# Altium project EPS.PrjPcb (part 1 of 4)
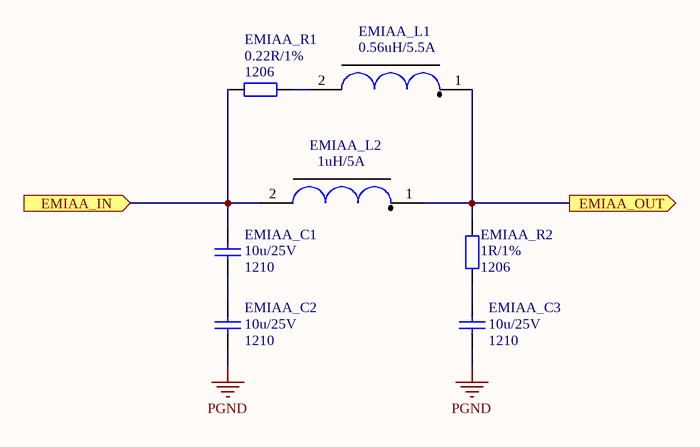
[diagram p0: EPS_3V3_EMI-Filter_In.SchDoc]
ApprovedBy_Name: (not approved); Author_Name: Piotr Kuligowski; CheckedBy_Name: (not checked); Equipment: EPS; Model: EM2; PCB_Author: (pcbdoc author); PCB_CheckedBy: (not checked); PCB_DocName: EPS; PCB_DocNo: PWSat2-xxx-DW-xxx; PCB_Revision: 1; Project_FullName: PW-Sat2; Project_ShortName: PW-Sat2; Schematics_DocName: EPS; Schematics_DocNo: PWSat2-xxx-DW-xxx; Schematics_Revision: 2
39 sheets, 761 parts. Net scope: hierarchical (ports join the sheet entries above them; power ports are global).
Board file: EPS.PcbDoc
Sheets:
  EPS_3V3_EMI-Filter_In.SchDoc
  EPS_3V3_EMI-Filter_Out.SchDoc
  EPS_5V_EMI-Filter_In.SchDoc
  EPS_Battery_Controller_Current-Meas.SchDoc
  EPS_5V_Buck-Converter.SchDoc
  EPS_3V3_Buck-Converter.SchDoc
  EPS_Connectors.SchDoc
    Top = EPS_Top.SchDoc
      Controller A = EPS_CTRL_A.SchDoc
        I2C Repeater = EPS_I2C-Repeater.SchDoc
        CTRL-A_Supply = EPS_CTRL_AB_Supply.SchDoc
        Temperature-Sensor = EPS_Temperature-Sensor.SchDoc
      MPPT X = EPS_MPPT_X.SchDoc
        MPPTX Boost Converter = EPS_MPPT_X_Boost-Converter.SchDoc
        MPPTX Solar Panels ORing = EPS_MPPT_X_OR_Solar.SchDoc
        MPPTX EMI Filters for Solar Panels = EPS_MPPT_X_EMI-Filter_Solar-Panels.SchDoc
        MPPTX Interface to uC = EPS_MPPT_XY_Interface.SchDoc
        MPPTX Measurements = EPS_MPPT_XY_Measurements.SchDoc
        MPPTX Output EMI Filter = EPS_MPPT_X_EMI-Filter_Out.SchDoc
        MPPTX ORing to MPB = EPS_MPPT_X_OR_MPB.SchDoc
      MPPT Y+ = EPS_MPPT_Y.SchDoc
        MPPTY Buck-Boost Converter = EPS_MPPT_Y_Buck-Boost-Converter.SchDoc
        MPPTY Solar Panels ORing = EPS_MPPT_Y_OR_Solar.SchDoc
        MPPTY Interface to uC = EPS_MPPT_XY_Interface.SchDoc
        MPPTY Measurements = EPS_MPPT_XY_Measurements.SchDoc
        MPPTY ORing to MPB = EPS_MPPT_Y_OR_MPB.SchDoc
      RBL & Inrush Limit = EPS_RBL.SchDoc
      LCLs for DCDC = EPS_DCDC_RLCLs.SchDoc
        DCDC RLCL = EPS_DCDC_RLCL-FPF.SchDoc
        VBAT RLCL = EPS_DCDC_RLCL-FPF.SchDoc
      Local-Supply and WDTs = EPS_Local-Supply.SchDoc
        Local-Supply CTRL-A = EPS_Local-Supply_Channel.SchDoc
          Temperature-Sensor = EPS_Temperature-Sensor.SchDoc
        Local-Supply CTRL-B = EPS_Local-Supply_Channel.SchDoc
          Temperature-Sensor = EPS_Temperature-Sensor.SchDoc
      MPPT Y- = EPS_MPPT_Y.SchDoc
        MPPTY Buck-Boost Converter = EPS_MPPT_Y_Buck-Boost-Converter.SchDoc
        MPPTY Solar Panels ORing = EPS_MPPT_Y_OR_Solar.SchDoc
        MPPTY Interface to uC = EPS_MPPT_XY_Interface.SchDoc
        MPPTY Measurements = EPS_MPPT_XY_Measurements.SchDoc
        MPPTY ORing to MPB = EPS_MPPT_Y_OR_MPB.SchDoc
      Controller B = EPS_CTRL_B.SchDoc
        I2C Repeater = EPS_I2C-Repeater.SchDoc
        Temperature-Sensor = EPS_Temperature-Sensor.SchDoc
        CTRL-B_Supply = EPS_CTRL_AB_Supply.SchDoc
    PC-104 Stack Connector = EPS_Connectors_PC-104.SchDoc
  EPS_Distribution_LCL-FPF.SchDoc
  EPS_Distribution_LCL-TK.SchDoc
  EPS_Distribution_RLCL-FPF.SchDoc
  EPS_Battery_Heaters-Control.SchDoc
  EPS_Distribution_Measurements.SchDoc
  EPS_VBAT_EMI-Filter.SchDoc
  EPS_Battery_Controller_Diode.SchDoc
  EPS_Battery_Controller_RLCL.SchDoc

## Sheet EPS_3V3_EMI-Filter_In.SchDoc: 3V3 / EMI-Filter / In
size A4; ApprovedBy: (not approved); CheckedBy: (not checked); Author: Piotr Kuligowski; DocumentNumber: PWSat2-xxx-DW-xxx; Revision: 2; SheetNumber: 40; SheetTotal: 51; Model: EM2

### Parts
EMIAA_C1  Package: 1210  [SMD_Capacitor_1210]  (hidden comment: 10u/25V)
EMIAA_C2  Package: 1210  [SMD_Capacitor_1210]  (hidden comment: 10u/25V)
EMIAA_C3  Package: 1210  [SMD_Capacitor_1210]  (hidden comment: 10u/25V)
EMIAA_L1  0.56uH/5.5A  [Vishay_IHLP1212]
EMIAA_L2  1uH/5A  [Vishay_IHLP1212]
EMIAA_R1  Package: 1206  [SMD_Resistor_1206]  (hidden comment: 0.22R/1%)
EMIAA_R2  Package: 1206  [SMD_Resistor_1206]  (hidden comment: 1R/1%)

### Ports
EMIAA_IN (in), EMIAA_OUT (out)

### Nets
PGND: EMIAA_C2.2 EMIAA_C3.2
NetEMIAA_C1_1: EMIAA_C1.1 EMIAA_L2.2 EMIAA_R1.1 ; port EMIAA_IN
NetEMIAA_C1_2: EMIAA_C1.2 EMIAA_C2.1
NetEMIAA_C3_1: EMIAA_C3.1 EMIAA_R2.1
NetEMIAA_L1_1: EMIAA_L1.1 EMIAA_L2.1 EMIAA_R2.2 ; port EMIAA_OUT
NetEMIAA_L1_2: EMIAA_L1.2 EMIAA_R1.2

### Notes on the sheet
- Title:
- Project:
- Author:
- Model:
- Document Number:
- Checked by:
- Rev:
- Date:
- Approved by:
- Sheet:
- of
- File name:

### Library data of the parts
EMIAA_C1-EMIAA_C3 = Cer_GCJ32ER71E106KA12L: Ceramic Cap Murata Automotive 10u/25V X7R 1210; Manufacturer: Murata; ManufacturerPartNumber: GCJ32ER71E106KA12L; Value: 10u/25V
EMIAA_L1 = IHLP1212BZERR56M11: Vishay IHLP1212 Inductor, L=0.56uH, Irise40deg=5.5A, ESR=16mR, SRF=1MHz.; Manufacturer: Vishay; ManufacturerPartNumber: IHLP1212BZERR56M11; Value: 0.56uH/5.5A
EMIAA_L2 = IHLP1212BZER1R0M11: Vishay IHLP1212 Inductor, L=1uH, Irise40deg=5A, ESR=20mR, SRF=1MHz.; Manufacturer: Vishay; ManufacturerPartNumber: IHLP1212BZER1R0M11; Value: 1uH/5A
EMIAA_R1 = ERJ-8BQFR22V: Panasonic Resistor 0.22R 1% 1206 330mW; Manufacturer: Panasonic; ManufacturerPartNumber: ERJ-8BQFR22V; Value: 0.22R/1%
EMIAA_R2 = ERJ-8BQF1R0V: Panasonic Resistor 1R 1% 1206 330mW; ManufacturerPartNumber: ERJ-8BQF1R0V; Manufacturer: Panasonic; Value: 1R/1%

## Sheet EPS_3V3_EMI-Filter_Out.SchDoc: 3V3 / EMI-Filter / Out
size A4; ApprovedBy: (not approved); CheckedBy: (not checked); Author: Piotr Kuligowski; DocumentNumber: PWSat2-xxx-DW-xxx; Revision: 2; SheetNumber: 42; SheetTotal: 51; Model: EM2
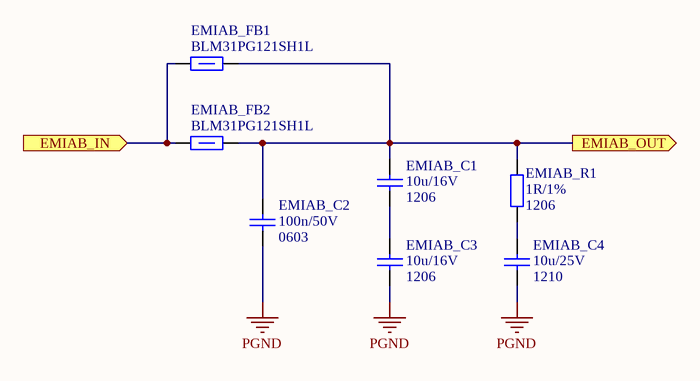
[diagram p1: EPS_3V3_EMI-Filter_Out.SchDoc]

### Parts
EMIAB_C1  Packge: 1206  [SMD_Capacitor_1206]  (hidden comment: 10u/16V)
EMIAB_C2  Package: 0603  [SMD_Capacitor_0603]  (hidden comment: 100n/50V)
EMIAB_C3  Packge: 1206  [SMD_Capacitor_1206]  (hidden comment: 10u/16V)
EMIAB_C4  Package: 1210  [SMD_Capacitor_1210]  (hidden comment: 10u/25V)
EMIAB_FB1  120R/100MHz  [SMD_FerriteBead_1206]  (value not drawn)
EMIAB_FB2  120R/100MHz  [SMD_FerriteBead_1206]  (value not drawn)
EMIAB_R1  Package: 1206  [SMD_Resistor_1206]  (hidden comment: 1R/1%)

### Ports
EMIAB_IN (in), EMIAB_OUT (out)

### Nets
PGND: EMIAB_C2.2 EMIAB_C3.2 EMIAB_C4.2
NetEMIAB_C1_1: EMIAB_C1.1 EMIAB_C2.1 EMIAB_FB1.1 EMIAB_FB2.1 EMIAB_R1.1 ; port EMIAB_OUT
NetEMIAB_C1_2: EMIAB_C1.2 EMIAB_C3.1
NetEMIAB_C4_1: EMIAB_C4.1 EMIAB_R1.2
NetEMIAB_FB1_2: EMIAB_FB1.2 EMIAB_FB2.2 ; port EMIAB_IN

### Notes on the sheet
- Title:
- Project:
- Author:
- Model:
- Document Number:
- Checked by:
- Rev:
- Date:
- Approved by:
- Sheet:
- of
- File name:

### Library data of the parts
EMIAB_C1 EMIAB_C3 = Cer_C1206T106K4RACTU: Ceramic Cap Kemet COTS 10u/16V X7R 1206; ManufacturerPartNumber: C1206T106K4RACTU; Manufacturer: Kemet; Value: 10u/16V
EMIAB_C2 = Cer_C0603T104K5RALTU: Ceramic Cap Kemet COTS 100n/50V X7R 0603; Manufacturer: Kemet; ManufacturerPartNumber: C0603T104K5RALTU; Value: 100n/50V
EMIAB_C4 = Cer_GCJ32ER71E106KA12L: as EMIAA_C1 on sheet EPS_3V3_EMI-Filter_In; Manufacturer: Murata; ManufacturerPartNumber: GCJ32ER71E106KA12L; Value: 10u/25V
EMIAB_FB1 EMIAB_FB2 = BLM31PG121SH1L: Ferrite bead, 1206, 0.02HM, 3.5A.; Manufacturer: Murata; Current Rating: 3.5A; Series Resistance DC: 0.02R; Package: 1206; Value: 120R/100MHz; ManufacturerPartNumber: BLM31PG121SH1L
EMIAB_R1 = CRCW12061R00FKxxxx: 1R/1% Vishay CRCW 1206 Resistor. 250mW, 100ppm, 200V.; ManufacturerPartNumber: CRCW12061R00FKxxxx; Manufacturer: Vishay; Value: 1R/1%

## Sheet EPS_5V_EMI-Filter_In.SchDoc: 5V / EMI-Filter / In
size A4; ApprovedBy: (not approved); CheckedBy: (not checked); Author: Piotr Kuligowski; DocumentNumber: PWSat2-xxx-DW-xxx; Revision: 2; SheetNumber: 44; SheetTotal: 51; Model: EM2
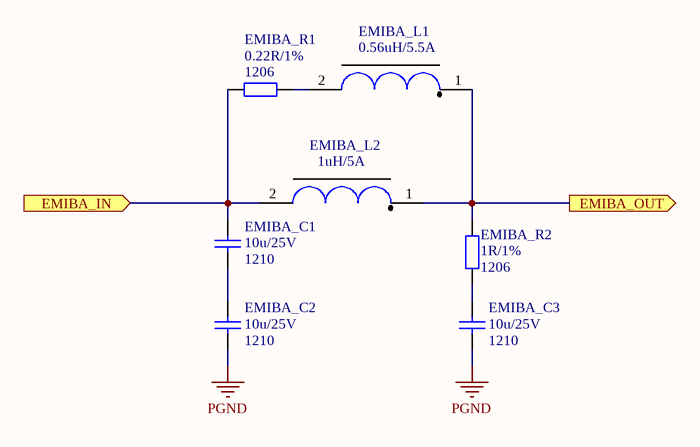
[diagram p2: EPS_5V_EMI-Filter_In.SchDoc]

### Parts
EMIBA_C1  Package: 1210  [SMD_Capacitor_1210]  (hidden comment: 10u/25V)
EMIBA_C2  Package: 1210  [SMD_Capacitor_1210]  (hidden comment: 10u/25V)
EMIBA_C3  Package: 1210  [SMD_Capacitor_1210]  (hidden comment: 10u/25V)
EMIBA_L1  0.56uH/5.5A  [Vishay_IHLP1212]
EMIBA_L2  1uH/5A  [Vishay_IHLP1212]
EMIBA_R1  Package: 1206  [SMD_Resistor_1206]  (hidden comment: 0.22R/1%)
EMIBA_R2  Package: 1206  [SMD_Resistor_1206]  (hidden comment: 1R/1%)

### Ports
EMIBA_IN (in), EMIBA_OUT (out)

### Nets
PGND: EMIBA_C2.2 EMIBA_C3.2
NetEMIBA_C1_1: EMIBA_C1.1 EMIBA_L2.2 EMIBA_R1.1 ; port EMIBA_IN
NetEMIBA_C1_2: EMIBA_C1.2 EMIBA_C2.1
NetEMIBA_C3_1: EMIBA_C3.1 EMIBA_R2.1
NetEMIBA_L1_1: EMIBA_L1.1 EMIBA_L2.1 EMIBA_R2.2 ; port EMIBA_OUT
NetEMIBA_L1_2: EMIBA_L1.2 EMIBA_R1.2

### Notes on the sheet
- Title:
- Project:
- Author:
- Model:
- Document Number:
- Checked by:
- Rev:
- Date:
- Approved by:
- Sheet:
- of
- File name:

### Library data of the parts
EMIBA_C1-EMIBA_C3 = Cer_GCJ32ER71E106KA12L: as EMIAA_C1 on sheet EPS_3V3_EMI-Filter_In; Manufacturer: Murata; ManufacturerPartNumber: GCJ32ER71E106KA12L; Value: 10u/25V
EMIBA_L1 = IHLP1212BZERR56M11: as EMIAA_L1 on sheet EPS_3V3_EMI-Filter_In; Manufacturer: Vishay; ManufacturerPartNumber: IHLP1212BZERR56M11; Value: 0.56uH/5.5A
EMIBA_L2 = IHLP1212BZER1R0M11: as EMIAA_L2 on sheet EPS_3V3_EMI-Filter_In; Manufacturer: Vishay; ManufacturerPartNumber: IHLP1212BZER1R0M11; Value: 1uH/5A
EMIBA_R1 = ERJ-8BQFR22V: Panasonic Resistor 0.22R 1% 1206 330mW; Manufacturer: Panasonic; ManufacturerPartNumber: ERJ-8BQFR22V; Value: 0.22R/1%
EMIBA_R2 = ERJ-8BQF1R0V: Panasonic Resistor 1R 1% 1206 330mW; ManufacturerPartNumber: ERJ-8BQF1R0V; Manufacturer: Panasonic; Value: 1R/1%

## Sheet EPS_Battery_Controller_Current-Meas.SchDoc: Battery / Current Measurement
size A4; ApprovedBy: (not approved); CheckedBy: (not checked); Author: Piotr Kuligowski; DocumentNumber: PWSat2-xxx-DW-xxx; Revision: 2; SheetNumber: 29; SheetTotal: 51; Model: EM2
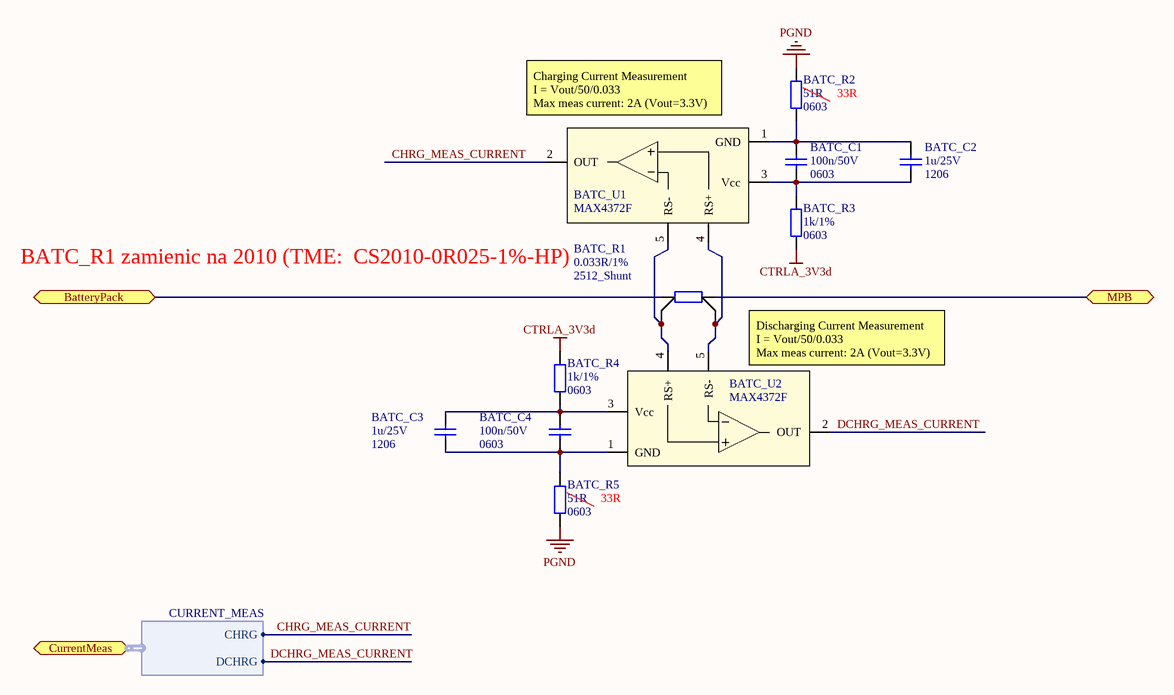
[diagram p3: EPS_Battery_Controller_Current-Meas.SchDoc]

### Parts
BATC_C1  Package: 0603  [SMD_Capacitor_0603]  (hidden comment: 100n/50V)
BATC_C2  Package: 1206  [SMD_Capacitor_1206]  (hidden comment: 1u/25V)
BATC_C3  Package: 1206  [SMD_Capacitor_1206]  (hidden comment: 1u/25V)
BATC_C4  Package: 0603  [SMD_Capacitor_0603]  (hidden comment: 100n/50V)
BATC_R1  Package: 2512_Shunt  [SMD_Resistor-shunt_2512]  (hidden comment: 0.033R/1%)
BATC_R2  Package: 0603  [SMD_Resistor_0603]  (hidden comment: 51R)
BATC_R3  Package: 0603  [SMD_Resistor_0603]  (hidden comment: 1k/1%)
BATC_R4  Package: 0603  [SMD_Resistor_0603]  (hidden comment: 1k/1%)
BATC_R5  Package: 0603  [SMD_Resistor_0603]  (hidden comment: 51R)
BATC_U1  MAX4372F  [SOT23-5]
BATC_U2  MAX4372F  [SOT23-5]

### Ports
BatteryPack, CurrentMeas (harness CURRENT_MEAS), MPB (bidir)

### Harnesses
CURRENT_MEAS: CHRG, DCHRG

### Nets
CTRLA_3V3d: BATC_R3.1 BATC_R4.1
PGND: BATC_R2.2 BATC_R5.1
CHRG_MEAS_CURRENT: BATC_U1.2(OUT) ; port CurrentMeas.CHRG
DCHRG_MEAS_CURRENT: BATC_U2.2(OUT) ; port CurrentMeas.DCHRG
NetBATC_C1_1: BATC_C1.1 BATC_C2.1 BATC_R2.1 BATC_U1.1(GND)
NetBATC_C1_2: BATC_C1.2 BATC_C2.2 BATC_R3.2 BATC_U1.3(Vcc)
NetBATC_C3_1: BATC_C3.1 BATC_C4.1 BATC_R4.2 BATC_U2.3(Vcc)
NetBATC_C3_2: BATC_C3.2 BATC_C4.2 BATC_R5.2 BATC_U2.1(GND)
NetBATC_R1_1: BATC_R1.1 ; port BatteryPack
NetBATC_R1_2: BATC_R1.2 BATC_U1.5(RS-) BATC_U2.4(RS+)
NetBATC_R1_3: BATC_R1.3 BATC_U1.4(RS+) BATC_U2.5(RS-)
NetBATC_R1_4: BATC_R1.4 ; port MPB

### Notes on the sheet
- (near BATC_U1) Charging Current Measurement
  I = Vout/50/0.033
  Max meas current: 2A (Vout=3.3V)
- (near BATC_R2) 33R
- (near BATC_U1) BATC_R1 zamienic na 2010 (TME:  CS2010-0R025-1%-HP)
- (near BATC_U2) Discharging Current Measurement
  I = Vout/50/0.033
  Max meas current: 2A (Vout=3.3V)
- 33R
- Title:
- Project:
- Author:
- Model:
- Document Number:
- Checked by:
- Rev:
- Date:
- Approved by:
- Sheet:
- of
- File name:

### Library data of the parts
BATC_C1 BATC_C4 = Cer_GCJ188R71H104KA12D: Ceramic Cap Murata Automotive 100n/50V X7R 0603; Manufacturer: Murata; ManufacturerPartNumber: GCJ188R71H104KA12D; Value: 100n/50V
BATC_C2 BATC_C3 = Cer_C1206T105K3RALTU: Ceramic Cap Kemet COTS 1u/25V X7R 1206; ManufacturerPartNumber: C1206T105K3RALTU; Manufacturer: Kemet; Value: 1u/25V
BATC_R1 = LR2512-R033FW: 33mR ,1%, 2W, shunt resistor, TE Connectivity.; ManufacturerPartNumber: LR2512-R033FW; Manufacturer: TE Connectivity; Power Rating: 2W; Value: 0.033R/1%
BATC_R2-BATC_R5 = Res
  BATC_R2 BATC_R5: Value: 51R
  BATC_R3 BATC_R4: Value: 1k/1%
BATC_U1 BATC_U2 = MAX4372: High-Side Current-Sense Amplifier with Voltage Output; Manufacturer: Maxim Integrated Products; Value: MAX4372F

## Sheet EPS_5V_Buck-Converter.SchDoc: 5V / Buck-Converter
size A4; ApprovedBy: (not approved); CheckedBy: (not checked); Author: Piotr Kuligowski; DocumentNumber: PWSat2-xxx-DW-xxx; Revision: 2; SheetNumber: 45; SheetTotal: 51; Model: EM2
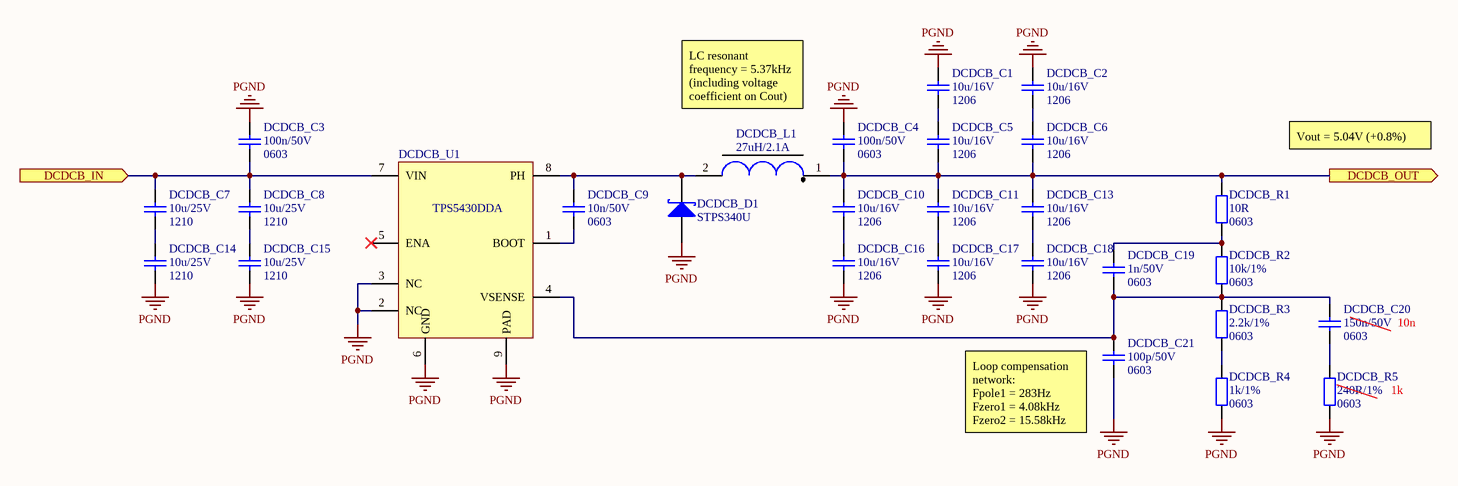
[diagram p4: EPS_5V_Buck-Converter.SchDoc]

### Parts
DCDCB_C1  Packge: 1206  [SMD_Capacitor_1206]  (hidden comment: 10u/16V)
DCDCB_C2  Packge: 1206  [SMD_Capacitor_1206]  (hidden comment: 10u/16V)
DCDCB_C3  Package: 0603  [SMD_Capacitor_0603]  (hidden comment: 100n/50V)
DCDCB_C4  Package: 0603  [SMD_Capacitor_0603]  (hidden comment: 100n/50V)
DCDCB_C5  Packge: 1206  [SMD_Capacitor_1206]  (hidden comment: 10u/16V)
DCDCB_C6  Packge: 1206  [SMD_Capacitor_1206]  (hidden comment: 10u/16V)
DCDCB_C7  Package: 1210  [SMD_Capacitor_1210]  (hidden comment: 10u/25V)
DCDCB_C8  Package: 1210  [SMD_Capacitor_1210]  (hidden comment: 10u/25V)
DCDCB_C9  value 10n/50V  Package: 0603  [SMD_Capacitor_0603]  (hidden comment: Cap)
DCDCB_C10  Packge: 1206  [SMD_Capacitor_1206]  (hidden comment: 10u/16V)
DCDCB_C11  Packge: 1206  [SMD_Capacitor_1206]  (hidden comment: 10u/16V)
DCDCB_C13  Packge: 1206  [SMD_Capacitor_1206]  (hidden comment: 10u/16V)
DCDCB_C14  Package: 1210  [SMD_Capacitor_1210]  (hidden comment: 10u/25V)
DCDCB_C15  Package: 1210  [SMD_Capacitor_1210]  (hidden comment: 10u/25V)
DCDCB_C16  Packge: 1206  [SMD_Capacitor_1206]  (hidden comment: 10u/16V)
DCDCB_C17  Packge: 1206  [SMD_Capacitor_1206]  (hidden comment: 10u/16V)
DCDCB_C18  Packge: 1206  [SMD_Capacitor_1206]  (hidden comment: 10u/16V)
DCDCB_C19  value 1n/50V  Package: 0603  [SMD_Capacitor_0603]  (hidden comment: Cap)
DCDCB_C20  Package: 0603  [SMD_Capacitor_0603]  (hidden comment: 150n/50V)
DCDCB_C21  value 100p/50V  Package: 0603  [SMD_Capacitor_0603]  (hidden comment: Cap)
DCDCB_D1  STPS340U  [DO-214AA]
DCDCB_L1  27uH/2.1A  [Coilcraft_MSS1260]
DCDCB_R1  Package: 0603  [SMD_Resistor_0603]  (hidden comment: 10R)
DCDCB_R2  Package: 0603  [SMD_Resistor_0603]  (hidden comment: 10k/1%)
DCDCB_R3  Package: 0603  [SMD_Resistor_0603]  (hidden comment: 2.2k/1%)
DCDCB_R4  Package: 0603  [SMD_Resistor_0603]  (hidden comment: 1k/1%)
DCDCB_R5  Package: 0603  [SMD_Resistor_0603]  (hidden comment: 240R/1%)
DCDCB_U1  TPS5430DDA  [DDA-9]

### Ports
DCDCB_IN (in), DCDCB_OUT (out)

### Nets
PGND: DCDCB_C1.1 DCDCB_C2.1 DCDCB_C3.2 DCDCB_C4.2 DCDCB_C14.2 DCDCB_C15.2 DCDCB_C16.2 DCDCB_C17.2 DCDCB_C18.2 DCDCB_C21.2 DCDCB_D1.A DCDCB_R4.1 DCDCB_R5.1 DCDCB_U1.2(NC) DCDCB_U1.3(NC) DCDCB_U1.6(GND) DCDCB_U1.9(PAD)
NetDCDCB_C1_2: DCDCB_C1.2 DCDCB_C5.1
NetDCDCB_C2_2: DCDCB_C2.2 DCDCB_C6.1
NetDCDCB_C3_1: DCDCB_C3.1 DCDCB_C7.1 DCDCB_C8.1 DCDCB_U1.7(VIN) ; port DCDCB_IN
NetDCDCB_C4_1: DCDCB_C4.1 DCDCB_C5.2 DCDCB_C6.2 DCDCB_C10.1 DCDCB_C11.1 DCDCB_C13.1 DCDCB_L1.1 DCDCB_R1.2 ; port DCDCB_OUT
NetDCDCB_C7_2: DCDCB_C7.2 DCDCB_C14.1
NetDCDCB_C8_2: DCDCB_C8.2 DCDCB_C15.1
NetDCDCB_C9_1: DCDCB_C9.1 DCDCB_D1.K DCDCB_L1.2 DCDCB_U1.8(PH)
NetDCDCB_C9_2: DCDCB_C9.2 DCDCB_U1.1(BOOT)
NetDCDCB_C10_2: DCDCB_C10.2 DCDCB_C16.1
NetDCDCB_C11_2: DCDCB_C11.2 DCDCB_C17.1
NetDCDCB_C13_2: DCDCB_C13.2 DCDCB_C18.1
NetDCDCB_C19_1: DCDCB_C19.1 DCDCB_R1.1 DCDCB_R2.2
NetDCDCB_C19_2: DCDCB_C19.2 DCDCB_C20.1 DCDCB_C21.1 DCDCB_R2.1 DCDCB_R3.2 DCDCB_U1.4(VSENSE)
NetDCDCB_C20_2: DCDCB_C20.2 DCDCB_R5.2
NetDCDCB_R3_1: DCDCB_R3.1 DCDCB_R4.2

Not connected (* = marked no-connect by the designer): DCDCB_U1 5(ENA)*

### Notes on the sheet
- LC resonant frequency = 5.37kHz (including voltage coefficient on Cout)
- Vout = 5.04V (+0.8%)
- 10n
- 1k
- (near DCDCB_C21) Loop compensation network:
  Fpole1 = 283Hz
  Fzero1 = 4.08kHz
  Fzero2 = 15.58kHz
- Title:
- Project:
- Author:
- Model:
- Document Number:
- Checked by:
- Rev:
- Date:
- Approved by:
- Sheet:
- of
- File name:

### Library data of the parts
DCDCB_C1 DCDCB_C2 DCDCB_C5 DCDCB_C6 DCDCB_C10 DCDCB_C11 DCDCB_C13 DCDCB_C16-DCDCB_C18 = Cer_C1206T106K4RACTU: Ceramic Cap Kemet COTS 10u/16V X7R 1206; ManufacturerPartNumber: C1206T106K4RACTU; Manufacturer: Kemet; Value: 10u/16V
DCDCB_C3 DCDCB_C4 = Cer_GCJ188R71H104KA12D: as BATC_C1 on sheet EPS_Battery_Controller_Current-Meas; Manufacturer: Murata; ManufacturerPartNumber: GCJ188R71H104KA12D; Value: 100n/50V
DCDCB_C7 DCDCB_C8 DCDCB_C14 DCDCB_C15 = Cer_GCJ32ER71E106KA12L: as EMIAA_C1 on sheet EPS_3V3_EMI-Filter_In; Manufacturer: Murata; ManufacturerPartNumber: GCJ32ER71E106KA12L; Value: 10u/25V
DCDCB_C20 = Cer_GCM188R71H154KA64D: Ceramic Cap Murata Automotive 150n/50V X7R 0603; Manufacturer: Murata; ManufacturerPartNumber: GCM188R71H154KA64D; Value: 150n/50V
DCDCB_D1 = STPS340x: 3A/40V Power Schottky Rectifier.; Manufacturer: STMicroelectronics; Value: STPS340U
DCDCB_L1 = MSS1260-273MLx: Coilcraft MSS1260 Inductor, L=27uH, Irise20deg=2.1A, ESR=50mR, SRF=13MHz.; Manufacturer: Coilcraft; ManufacturerPartNumber: MSS1260-273MLx; Value: 27uH/2.1A
DCDCB_R1-DCDCB_R5 = Res
  DCDCB_R1: Value: 10R
  DCDCB_R2: Value: 10k/1%
  DCDCB_R3: Value: 2.2k/1%
  DCDCB_R4: Value: 1k/1%
  DCDCB_R5: Value: 240R/1%
DCDCB_U1 = TPS5430: TPS5430 3-A, Wide Input Range, Step-Down Converter; Manufacturer: Texas Instruments; Value: TPS5430DDA

## Sheet EPS_3V3_Buck-Converter.SchDoc: 3V3 / Buck-Converter
size A4; ApprovedBy: (not approved); CheckedBy: (not checked); Author: Piotr Kuligowski; DocumentNumber: PWSat2-xxx-DW-xxx; Revision: 2; SheetNumber: 41; SheetTotal: 51; Model: EM2
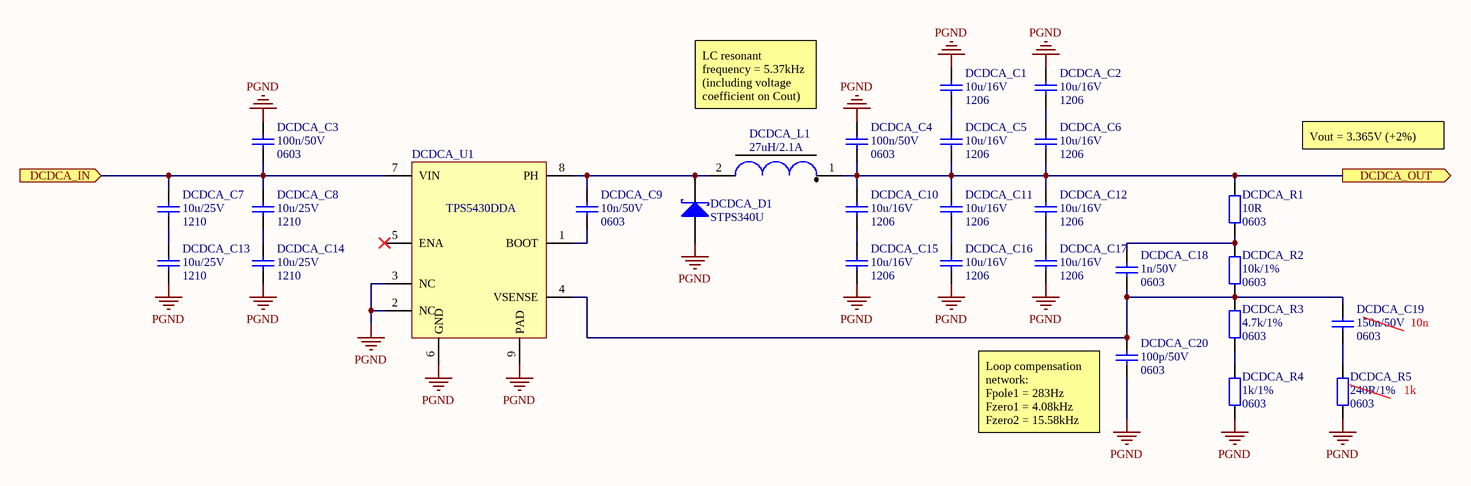
[diagram p5: EPS_3V3_Buck-Converter.SchDoc]

### Parts
DCDCA_C1  Packge: 1206  [SMD_Capacitor_1206]  (hidden comment: 10u/16V)
DCDCA_C2  Packge: 1206  [SMD_Capacitor_1206]  (hidden comment: 10u/16V)
DCDCA_C3  Package: 0603  [SMD_Capacitor_0603]  (hidden comment: 100n/50V)
DCDCA_C4  Package: 0603  [SMD_Capacitor_0603]  (hidden comment: 100n/50V)
DCDCA_C5  Packge: 1206  [SMD_Capacitor_1206]  (hidden comment: 10u/16V)
DCDCA_C6  Packge: 1206  [SMD_Capacitor_1206]  (hidden comment: 10u/16V)
DCDCA_C7  Package: 1210  [SMD_Capacitor_1210]  (hidden comment: 10u/25V)
DCDCA_C8  Package: 1210  [SMD_Capacitor_1210]  (hidden comment: 10u/25V)
DCDCA_C9  value 10n/50V  Package: 0603  [SMD_Capacitor_0603]  (hidden comment: Cap)
DCDCA_C10  Packge: 1206  [SMD_Capacitor_1206]  (hidden comment: 10u/16V)
DCDCA_C11  Packge: 1206  [SMD_Capacitor_1206]  (hidden comment: 10u/16V)
DCDCA_C12  Packge: 1206  [SMD_Capacitor_1206]  (hidden comment: 10u/16V)
DCDCA_C13  Package: 1210  [SMD_Capacitor_1210]  (hidden comment: 10u/25V)
DCDCA_C14  Package: 1210  [SMD_Capacitor_1210]  (hidden comment: 10u/25V)
DCDCA_C15  Packge: 1206  [SMD_Capacitor_1206]  (hidden comment: 10u/16V)
DCDCA_C16  Packge: 1206  [SMD_Capacitor_1206]  (hidden comment: 10u/16V)
DCDCA_C17  Packge: 1206  [SMD_Capacitor_1206]  (hidden comment: 10u/16V)
DCDCA_C18  value 1n/50V  Package: 0603  [SMD_Capacitor_0603]  (hidden comment: Cap)
DCDCA_C19  Package: 0603  [SMD_Capacitor_0603]  (hidden comment: 150n/50V)
DCDCA_C20  value 100p/50V  Package: 0603  [SMD_Capacitor_0603]  (hidden comment: Cap)
DCDCA_D1  STPS340U  [DO-214AA]
DCDCA_L1  27uH/2.1A  [Coilcraft_MSS1260]
DCDCA_R1  Package: 0603  [SMD_Resistor_0603]  (hidden comment: 10R)
DCDCA_R2  Package: 0603  [SMD_Resistor_0603]  (hidden comment: 10k/1%)
DCDCA_R3  Package: 0603  [SMD_Resistor_0603]  (hidden comment: 4.7k/1%)
DCDCA_R4  Package: 0603  [SMD_Resistor_0603]  (hidden comment: 1k/1%)
DCDCA_R5  Package: 0603  [SMD_Resistor_0603]  (hidden comment: 240R/1%)
DCDCA_U1  TPS5430DDA  [DDA-9]

### Ports
DCDCA_IN (in), DCDCA_OUT (out)

### Nets
PGND: DCDCA_C1.1 DCDCA_C2.1 DCDCA_C3.2 DCDCA_C4.2 DCDCA_C13.2 DCDCA_C14.2 DCDCA_C15.2 DCDCA_C16.2 DCDCA_C17.2 DCDCA_C20.2 DCDCA_D1.A DCDCA_R4.1 DCDCA_R5.1 DCDCA_U1.2(NC) DCDCA_U1.3(NC) DCDCA_U1.6(GND) DCDCA_U1.9(PAD)
NetDCDCA_C1_2: DCDCA_C1.2 DCDCA_C5.1
NetDCDCA_C2_2: DCDCA_C2.2 DCDCA_C6.1
NetDCDCA_C3_1: DCDCA_C3.1 DCDCA_C7.1 DCDCA_C8.1 DCDCA_U1.7(VIN) ; port DCDCA_IN
NetDCDCA_C4_1: DCDCA_C4.1 DCDCA_C5.2 DCDCA_C6.2 DCDCA_C10.1 DCDCA_C11.1 DCDCA_C12.1 DCDCA_L1.1 DCDCA_R1.2 ; port DCDCA_OUT
NetDCDCA_C7_2: DCDCA_C7.2 DCDCA_C13.1
NetDCDCA_C8_2: DCDCA_C8.2 DCDCA_C14.1
NetDCDCA_C9_1: DCDCA_C9.1 DCDCA_D1.K DCDCA_L1.2 DCDCA_U1.8(PH)
NetDCDCA_C9_2: DCDCA_C9.2 DCDCA_U1.1(BOOT)
NetDCDCA_C10_2: DCDCA_C10.2 DCDCA_C15.1
NetDCDCA_C11_2: DCDCA_C11.2 DCDCA_C16.1
NetDCDCA_C12_2: DCDCA_C12.2 DCDCA_C17.1
NetDCDCA_C18_1: DCDCA_C18.1 DCDCA_R1.1 DCDCA_R2.2
NetDCDCA_C18_2: DCDCA_C18.2 DCDCA_C19.1 DCDCA_C20.1 DCDCA_R2.1 DCDCA_R3.2 DCDCA_U1.4(VSENSE)
NetDCDCA_C19_2: DCDCA_C19.2 DCDCA_R5.2
NetDCDCA_R3_1: DCDCA_R3.1 DCDCA_R4.2

Not connected (* = marked no-connect by the designer): DCDCA_U1 5(ENA)*

### Notes on the sheet
- LC resonant frequency = 5.37kHz (including voltage coefficient on Cout)
- Vout = 3.365V (+2%)
- 10n
- 1k
- (near DCDCA_C20) Loop compensation network:
  Fpole1 = 283Hz
  Fzero1 = 4.08kHz
  Fzero2 = 15.58kHz
- Title:
- Project:
- Author:
- Model:
- Document Number:
- Checked by:
- Rev:
- Date:
- Approved by:
- Sheet:
- of
- File name:

### Library data of the parts
DCDCA_C1 DCDCA_C2 DCDCA_C5 DCDCA_C6 DCDCA_C10-DCDCA_C12 DCDCA_C15-DCDCA_C17 = Cer_C1206T106K4RACTU: Ceramic Cap Kemet COTS 10u/16V X7R 1206; ManufacturerPartNumber: C1206T106K4RACTU; Manufacturer: Kemet; Value: 10u/16V
DCDCA_C3 DCDCA_C4 = Cer_GCJ188R71H104KA12D: as BATC_C1 on sheet EPS_Battery_Controller_Current-Meas; Manufacturer: Murata; ManufacturerPartNumber: GCJ188R71H104KA12D; Value: 100n/50V
DCDCA_C7 DCDCA_C8 DCDCA_C13 DCDCA_C14 = Cer_GCJ32ER71E106KA12L: as EMIAA_C1 on sheet EPS_3V3_EMI-Filter_In; Manufacturer: Murata; ManufacturerPartNumber: GCJ32ER71E106KA12L; Value: 10u/25V
DCDCA_C19 = Cer_GCM188R71H154KA64D: as DCDCB_C20 on sheet EPS_5V_Buck-Converter; Manufacturer: Murata; ManufacturerPartNumber: GCM188R71H154KA64D; Value: 150n/50V
DCDCA_D1 = STPS340x: as DCDCB_D1 on sheet EPS_5V_Buck-Converter; Value: STPS340U
DCDCA_L1 = MSS1260-273MLx: as DCDCB_L1 on sheet EPS_5V_Buck-Converter; Manufacturer: Coilcraft; ManufacturerPartNumber: MSS1260-273MLx; Value: 27uH/2.1A
DCDCA_R1-DCDCA_R5 = Res
  DCDCA_R1: Value: 10R
  DCDCA_R2: Value: 10k/1%
  DCDCA_R3: Value: 4.7k/1%
  DCDCA_R4: Value: 1k/1%
  DCDCA_R5: Value: 240R/1%
DCDCA_U1 = TPS5430: as DCDCB_U1 on sheet EPS_5V_Buck-Converter; Value: TPS5430DDA

## Sheet EPS_Connectors.SchDoc: Connectors
size A3; ApprovedBy: (not approved); CheckedBy: (not checked); Author: Piotr Kuligowski; DocumentNumber: PWSat2-xxx-DW-xxx; Revision: 2; SheetNumber: 1; SheetTotal: 51; Model: EM2
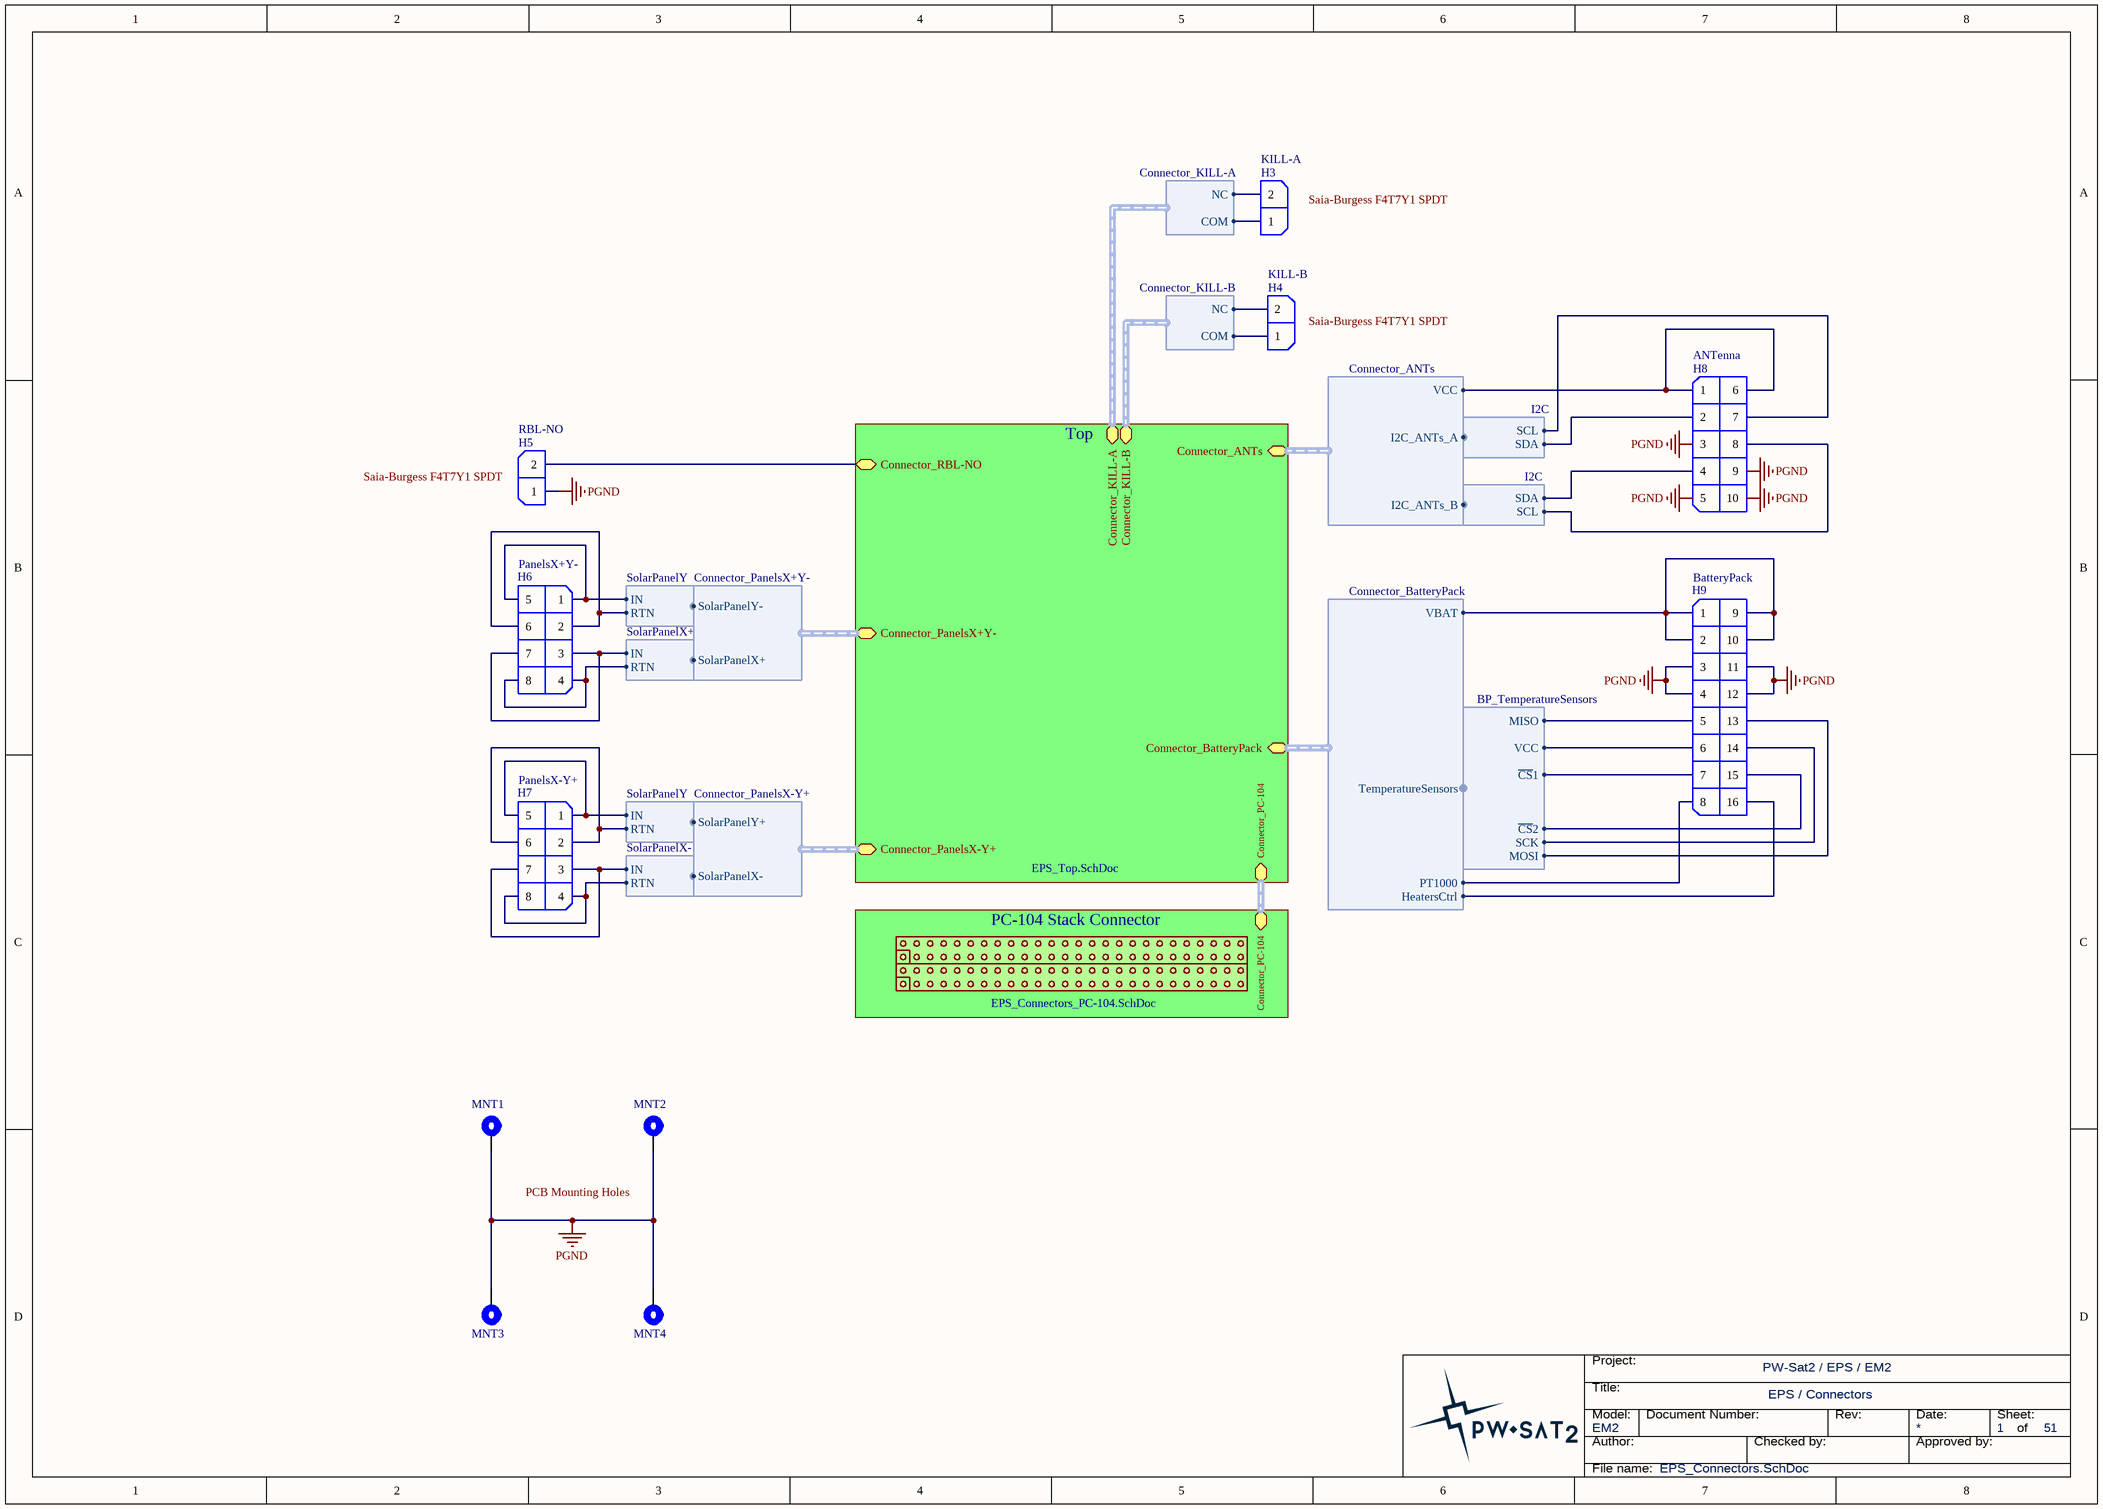
[diagram p6: EPS_Connectors.SchDoc]

### Parts
H3  KILL-A  [Harwin_Datamate_L-Tek_M80-8770222]
H4  KILL-B  [Harwin_Datamate_L-Tek_M80-8770222]
H5  RBL-NO  [Harwin_Datamate_L-Tek_M80-8770222]
H6  PanelsX+Y-  [Harwin_Datamate_L-Tek_M80-8670805]
H7  PanelsX-Y+  [Harwin_Datamate_L-Tek_M80-8670805]
H8  ANTenna  [Harwin_Datamate_L-Tek_M80-8671005]
H9  BatteryPack  [Harwin_Datamate_L-Tek_M80-8531642]
MNT1  Mounting Hole  [PC-104_PcbMntHole_M3]  (value not drawn)
MNT2  Mounting Hole  [PC-104_PcbMntHole_M3]  (value not drawn)
MNT3  Mounting Hole  [PC-104_PcbMntHole_M3]  (value not drawn)
MNT4  Mounting Hole  [PC-104_PcbMntHole_M3]  (value not drawn)

### Sub-sheets
PC-104 Stack Connector = EPS_Connectors_PC-104.SchDoc: Connector_PC-104 (harness Connector_PC-104)
Top = EPS_Top.SchDoc: Connector_PC-104 (harness Connector_PC-104), Connector_KILL-B (harness Connector_KILL-B), Connector_KILL-A (harness Connector_KILL-A), Connector_PanelsX+Y- (harness Connector_PanelsX+Y-), Connector_PanelsX-Y+ (harness Connector_PanelsX-Y+), Connector_ANTs (harness Connector_ANTs), Connector_BatteryPack (harness Connector_BatteryPack), Connector_RBL-NO (bidir)

### Harnesses
SolarPanelX-: IN, RTN
SolarPanelY: IN, RTN
SolarPanelX+: IN, RTN
Connector_PanelsX-Y+: SolarPanelX-, SolarPanelY+
Connector_PanelsX+Y-: SolarPanelX+, SolarPanelY-
Connector_KILL-A: COM, NC
Connector_KILL-B: COM, NC
I2C: SDA, SCL
Connector_ANTs: I2C_ANTs_A, VCC, I2C_ANTs_B
Connector_BatteryPack: VBAT, TemperatureSensors, HeatersCtrl, PT1000
BP_TemperatureSensors: MISO, VCC, ~{CS}1, ~{CS}2, SCK, MOSI

### Nets
PGND: H5.1 H8.3 H8.5 H8.9 H8.10 H9.3 H9.4 H9.11 H9.12 MNT1.1 MNT2.1 MNT3.1 MNT4.1
PC-104_I2C-Bus_SCL: H8.7 ; harness I2C.SCL
PC-104_I2C-Bus_SDA: H8.2 ; harness I2C.SDA
PC-104_I2C-Payload_SCL: H8.8 ; harness I2C.SCL
PC-104_I2C-Payload_SDA: H8.4 ; harness I2C.SDA
NetEMIXS_T1_1: H6.3 H6.7 ; harness SolarPanelX+.IN
NetEMIXS_T1_2: H6.4 H6.8 ; harness SolarPanelX+.RTN
NetEMIXS_T2_1: H7.3 H7.7 ; harness SolarPanelX-.IN
NetEMIXS_T2_2: H7.4 H7.8 ; harness SolarPanelX-.RTN
NetH3_1: H3.1 H4.1 ; sheet Top/Connector_KILL-A.COM, sheet Top/Connector_KILL-B.COM
NetH3_2: H3.2 H4.2 ; sheet Top/Connector_KILL-A.NC, sheet Top/Connector_KILL-B.NC
NetH5_2: H5.2 ; sheet Top/Connector_RBL-NO
NetH6_1: H6.1 H6.5 ; harness SolarPanelY.IN
NetH6_2: H6.2 H6.6 ; harness SolarPanelY.RTN
NetH7_1: H7.1 H7.5 ; harness SolarPanelY.IN
NetH7_2: H7.2 H7.6 ; harness SolarPanelY.RTN
NetH8_1: H8.1 H8.6 ; sheet Top/Connector_ANTs.VCC
NetH9_1: H9.1 H9.2 H9.9 H9.10 ; sheet Top/Connector_BatteryPack.VBAT
NetH9_5: H9.5 ; harness BP_TemperatureSensors.MISO
NetH9_6: H9.6 ; harness BP_TemperatureSensors.VCC
NetH9_7: H9.7 ; harness BP_TemperatureSensors.~{CS}1
NetH9_8: H9.8 ; sheet Top/Connector_BatteryPack.PT1000
NetH9_13: H9.13 ; harness BP_TemperatureSensors.MOSI
NetH9_14: H9.14 ; harness BP_TemperatureSensors.SCK
NetH9_15: H9.15 ; harness BP_TemperatureSensors.~{CS}2
NetH9_16: H9.16 ; sheet Top/Connector_BatteryPack.HeatersCtrl

### Buses and harness runs
harness sheet PC-104 Stack Connector/Connector_PC-104 = sheet Top/Connector_PC-104

### Notes on the sheet
- (near H3) Saia-Burgess F4T7Y1 SPDT
- (near H4) Saia-Burgess F4T7Y1 SPDT
- (near H5) Saia-Burgess F4T7Y1 SPDT
- PCB Mounting Holes
- Title:
- Project:
- Author:
- Model:
- Document Number:
- Checked by:
- Rev:
- Date:
- Approved by:
- Sheet:
- of
- File name:

### Library data of the parts
H3-H5 = Harwin_Datamate_L-Tek_1x2pin: Harwin DataMate L-Tek, 2mm pitch, 1x2pin.; Value: Harwin DataMate L-Tek 1x2pin
H6 H7 = Harwin_Datamate_L-Tek_2x4pin: Harwin DataMate L-Tek, 2mm pitch, 2x4pin.; Value: Harwin DataMate L-Tek 2x4pin
H8 = Harwin_Datamate_L-Tek_2x5pin: Harwin DataMate L-Tek, 2mm pitch, 2x5pin.; Value: Harwin DataMate L-Tek 2x5pin
H9 = Harwin_Datamate_L-Tek_2x8pin: Harwin DataMate L-Tek, 2mm pitch, 2x8pin.; Value: BatteryPack
MNT1-MNT4 = MntHole: PCB Mounting Hole; Value: Mounting Hole

## Sheet EPS_Top.SchDoc: Top
size A3; ApprovedBy: (not approved); CheckedBy: (not checked); Author: Piotr Kuligowski; DocumentNumber: PWSat2-xxx-DW-xxx; Revision: 2; SheetNumber: 3; SheetTotal: 51; Model: EM2
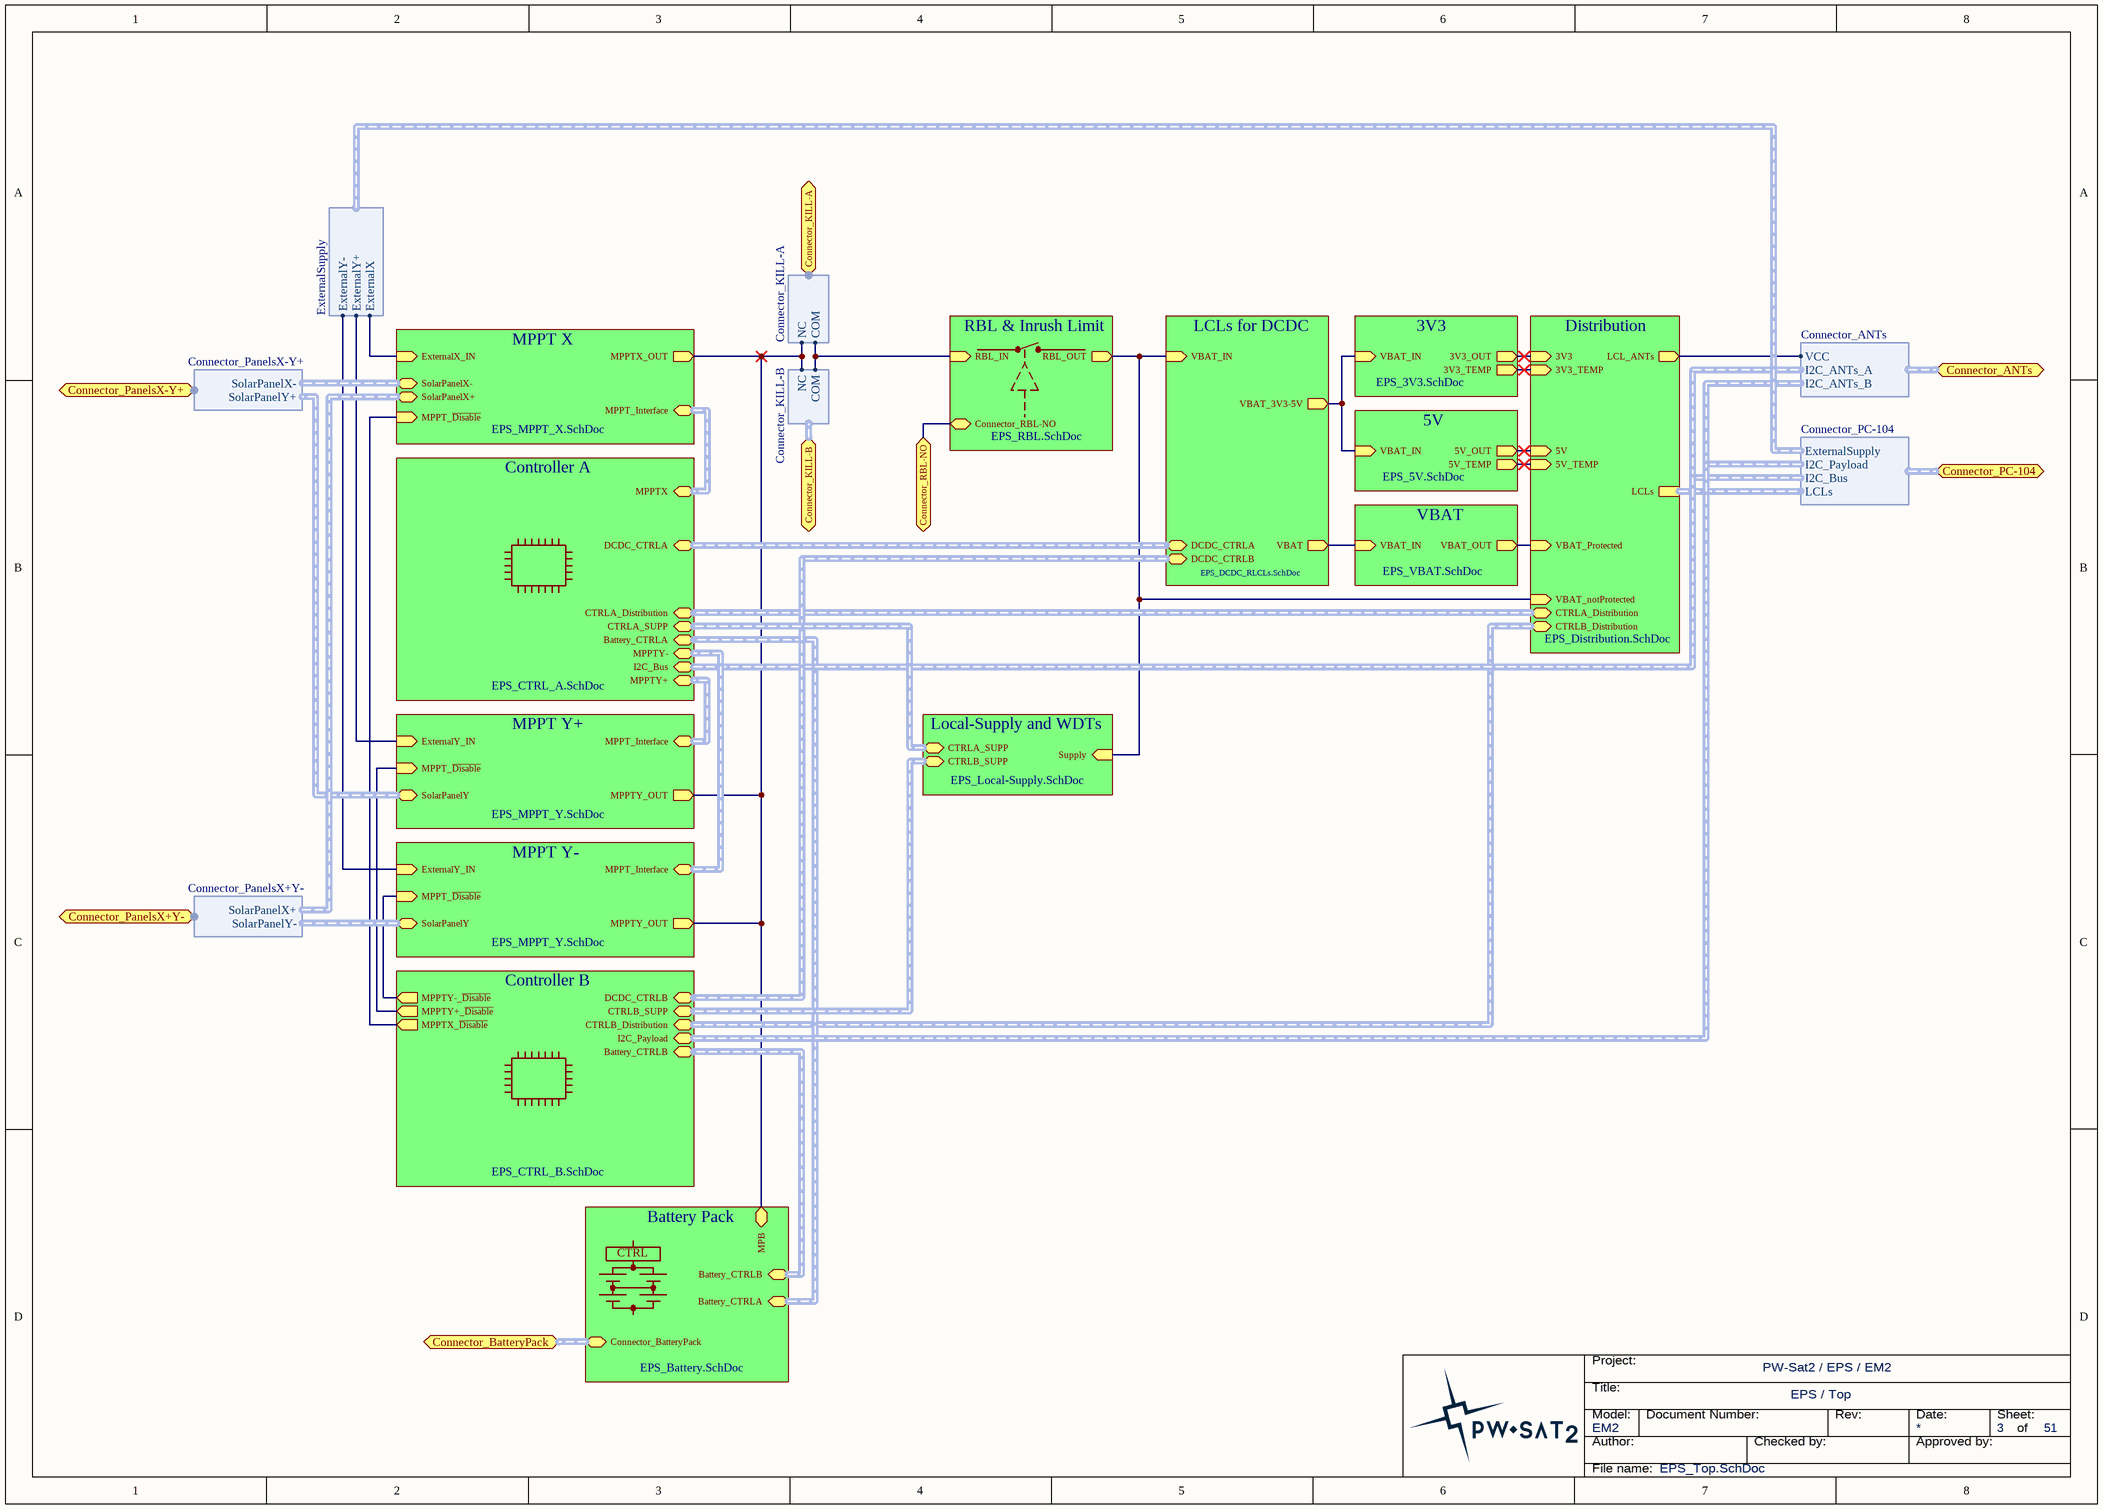
[diagram p7: EPS_Top.SchDoc]

### Sub-sheets
3V3 = EPS_3V3.SchDoc (file not in this document): 3V3_OUT (out), VBAT_IN (in), 3V3_TEMP (out)
5V = EPS_5V.SchDoc (file not in this document): 5V_OUT (out), VBAT_IN (in), 5V_TEMP (out)
Battery Pack = EPS_Battery.SchDoc (file not in this document): MPB (bidir), Connector_BatteryPack (harness Connector_BatteryPack), Battery_CTRLA (harness Battery_CTRLA), Battery_CTRLB (harness Battery_CTRLB)
Controller A = EPS_CTRL_A.SchDoc: CTRLA_Distribution (harness CTRLA_Distribution), Battery_CTRLA (harness Battery_CTRLA), I2C_Bus (harness I2C), MPPTX (harness MPPT_Interface), DCDC_CTRLA (harness DCDC_CTRLA), CTRLA_SUPP (harness CTRLA_SUPP), MPPTY+ (harness MPPT_Interface), MPPTY- (harness MPPT_Interface)
Controller B = EPS_CTRL_B.SchDoc: Battery_CTRLB (harness Battery_CTRLB), I2C_Payload (harness I2C), CTRLB_Distribution (harness CTRLB_Distribution), DCDC_CTRLB (harness DCDC_CTRLB), CTRLB_SUPP (harness CTRLB_SUPP), MPPTY-_~{Disable} (out), MPPTX_~{Disable} (out), MPPTY+_~{Disable} (out)
Distribution = EPS_Distribution.SchDoc (file not in this document): 3V3 (in), 5V (in), LCLs (harness LCLs), CTRLB_Distribution (harness CTRLB_Distribution), CTRLA_Distribution (harness CTRLA_Distribution), VBAT_notProtected (in), VBAT_Protected (in), LCL_ANTs (out), 3V3_TEMP (in), 5V_TEMP (in)
LCLs for DCDC = EPS_DCDC_RLCLs.SchDoc: VBAT_IN (in), VBAT_3V3-5V (out), VBAT (out), DCDC_CTRLB (harness DCDC_CTRLB), DCDC_CTRLA (harness DCDC_CTRLA)
Local-Supply and WDTs = EPS_Local-Supply.SchDoc: Supply (in), CTRLA_SUPP (harness CTRLA_SUPP), CTRLB_SUPP (harness CTRLB_SUPP)
MPPT X = EPS_MPPT_X.SchDoc: ExternalX_IN (in), SolarPanelX- (harness SolarPanelX-), SolarPanelX+ (harness SolarPanelX+), MPPTX_OUT (out), MPPT_Interface (harness MPPT_Interface), MPPT_~{Disable} (in)
MPPT Y+ = EPS_MPPT_Y.SchDoc: ExternalY_IN (in), SolarPanelY (harness SolarPanelY), MPPTY_OUT (out), MPPT_Interface (harness MPPT_Interface), MPPT_~{Disable} (in)
MPPT Y- = EPS_MPPT_Y.SchDoc: ExternalY_IN (in), SolarPanelY (harness SolarPanelY), MPPTY_OUT (out), MPPT_Interface (harness MPPT_Interface), MPPT_~{Disable} (in)
RBL & Inrush Limit = EPS_RBL.SchDoc: RBL_OUT (out), RBL_IN (in), Connector_RBL-NO (bidir)
VBAT = EPS_VBAT.SchDoc (file not in this document): VBAT_OUT (out), VBAT_IN (in)

### Ports
Connector_ANTs (harness Connector_ANTs), Connector_BatteryPack (harness Connector_BatteryPack), Connector_KILL-A (harness Connector_KILL-A), Connector_KILL-B (harness Connector_KILL-B), Connector_PanelsX+Y- (harness Connector_PanelsX+Y-), Connector_PanelsX-Y+ (harness Connector_PanelsX-Y+), Connector_PC-104 (harness Connector_PC-104), Connector_RBL-NO (bidir)

### Harnesses
Connector_KILL-A: COM, NC
Connector_KILL-B: COM, NC
Connector_PC-104: I2C_Payload, LCLs, I2C_Bus, ExternalSupply
Connector_PanelsX-Y+: SolarPanelX-, SolarPanelY+
Connector_PanelsX+Y-: SolarPanelX+, SolarPanelY-
Connector_ANTs: I2C_ANTs_A, VCC, I2C_ANTs_B
ExternalSupply: ExternalX, ExternalY-, ExternalY+

### Nets
PC-104_EXTX: sheet MPPT X/ExternalX_IN, harness ExternalSupply.ExternalX
PC-104_EXTY+: sheet MPPT Y+/ExternalY_IN, harness ExternalSupply.ExternalY+
PC-104_EXTY-: sheet MPPT Y-/ExternalY_IN, harness ExternalSupply.ExternalY-
NetCTRLB_U1_1: sheet MPPT X/MPPT_~{Disable}, sheet Controller B/MPPTX_~{Disable}
NetCTRLB_U1_2: sheet MPPT Y+/MPPT_~{Disable}, sheet Controller B/MPPTY+_~{Disable}
NetCTRLB_U1_3: sheet MPPT Y-/MPPT_~{Disable}, sheet Controller B/MPPTY-_~{Disable}
NetDRLCL_C1_1_1: sheet RBL & Inrush Limit/RBL_OUT, sheet Distribution/VBAT_notProtected, sheet LCLs for DCDC/VBAT_IN, sheet Local-Supply and WDTs/Supply
NetDRLCL_C4_1_1: sheet 3V3/VBAT_IN, sheet 5V/VBAT_IN, sheet LCLs for DCDC/VBAT_3V3-5V
NetDRLCL_C4_2_1: sheet VBAT/VBAT_IN, sheet LCLs for DCDC/VBAT
NetH3_1: sheet RBL & Inrush Limit/RBL_IN, port Connector_KILL-A.COM, port Connector_KILL-B.COM
NetH3_2: sheet MPPT X/MPPTX_OUT, sheet MPPT Y+/MPPTY_OUT, sheet Battery Pack/MPB, sheet MPPT Y-/MPPTY_OUT, port Connector_KILL-A.NC, port Connector_KILL-B.NC
NetH5_2: port Connector_RBL-NO, sheet RBL & Inrush Limit/Connector_RBL-NO
NetH8_1: sheet Distribution/LCL_ANTs, port Connector_ANTs.VCC
(unnamed): sheet 3V3/3V3_OUT, sheet Distribution/3V3
(unnamed): sheet 3V3/3V3_TEMP, sheet Distribution/3V3_TEMP
(unnamed): sheet 5V/5V_OUT, sheet Distribution/5V
(unnamed): sheet 5V/5V_TEMP, sheet Distribution/5V_TEMP
(unnamed): sheet Distribution/VBAT_Protected, sheet VBAT/VBAT_OUT

### Buses and harness runs
harness port Connector_BatteryPack = sheet Battery Pack/Connector_BatteryPack
harness sheet Battery Pack/Battery_CTRLA = sheet Controller A/Battery_CTRLA
harness sheet Battery Pack/Battery_CTRLB = sheet Controller B/Battery_CTRLB
harness sheet Controller A/CTRLA_Distribution = sheet Distribution/CTRLA_Distribution
harness sheet Controller A/CTRLA_SUPP = sheet Local-Supply and WDTs/CTRLA_SUPP
harness sheet Controller A/DCDC_CTRLA = sheet LCLs for DCDC/DCDC_CTRLA
harness sheet Controller A/MPPTX = sheet MPPT X/MPPT_Interface
harness sheet Controller A/MPPTY+ = sheet MPPT Y+/MPPT_Interface
harness sheet Controller A/MPPTY- = sheet MPPT Y-/MPPT_Interface
harness sheet Controller B/CTRLB_Distribution = sheet Distribution/CTRLB_Distribution
harness sheet Controller B/CTRLB_SUPP = sheet Local-Supply and WDTs/CTRLB_SUPP
harness sheet Controller B/DCDC_CTRLB = sheet LCLs for DCDC/DCDC_CTRLB

### Notes on the sheet
- CTRL
- Title:
- Project:
- Author:
- Model:
- Document Number:
- Checked by:
- Rev:
- Date:
- Approved by:
- Sheet:
- of
- File name:

## Sheet EPS_CTRL_A.SchDoc: CTRL-A
size A3; ApprovedBy: (not approved); CheckedBy: (not checked); Author: Piotr Kuligowski; DocumentNumber: PWSat2-xxx-DW-xxx; Revision: 2; SheetNumber: 13; SheetTotal: 51; Model: EM2
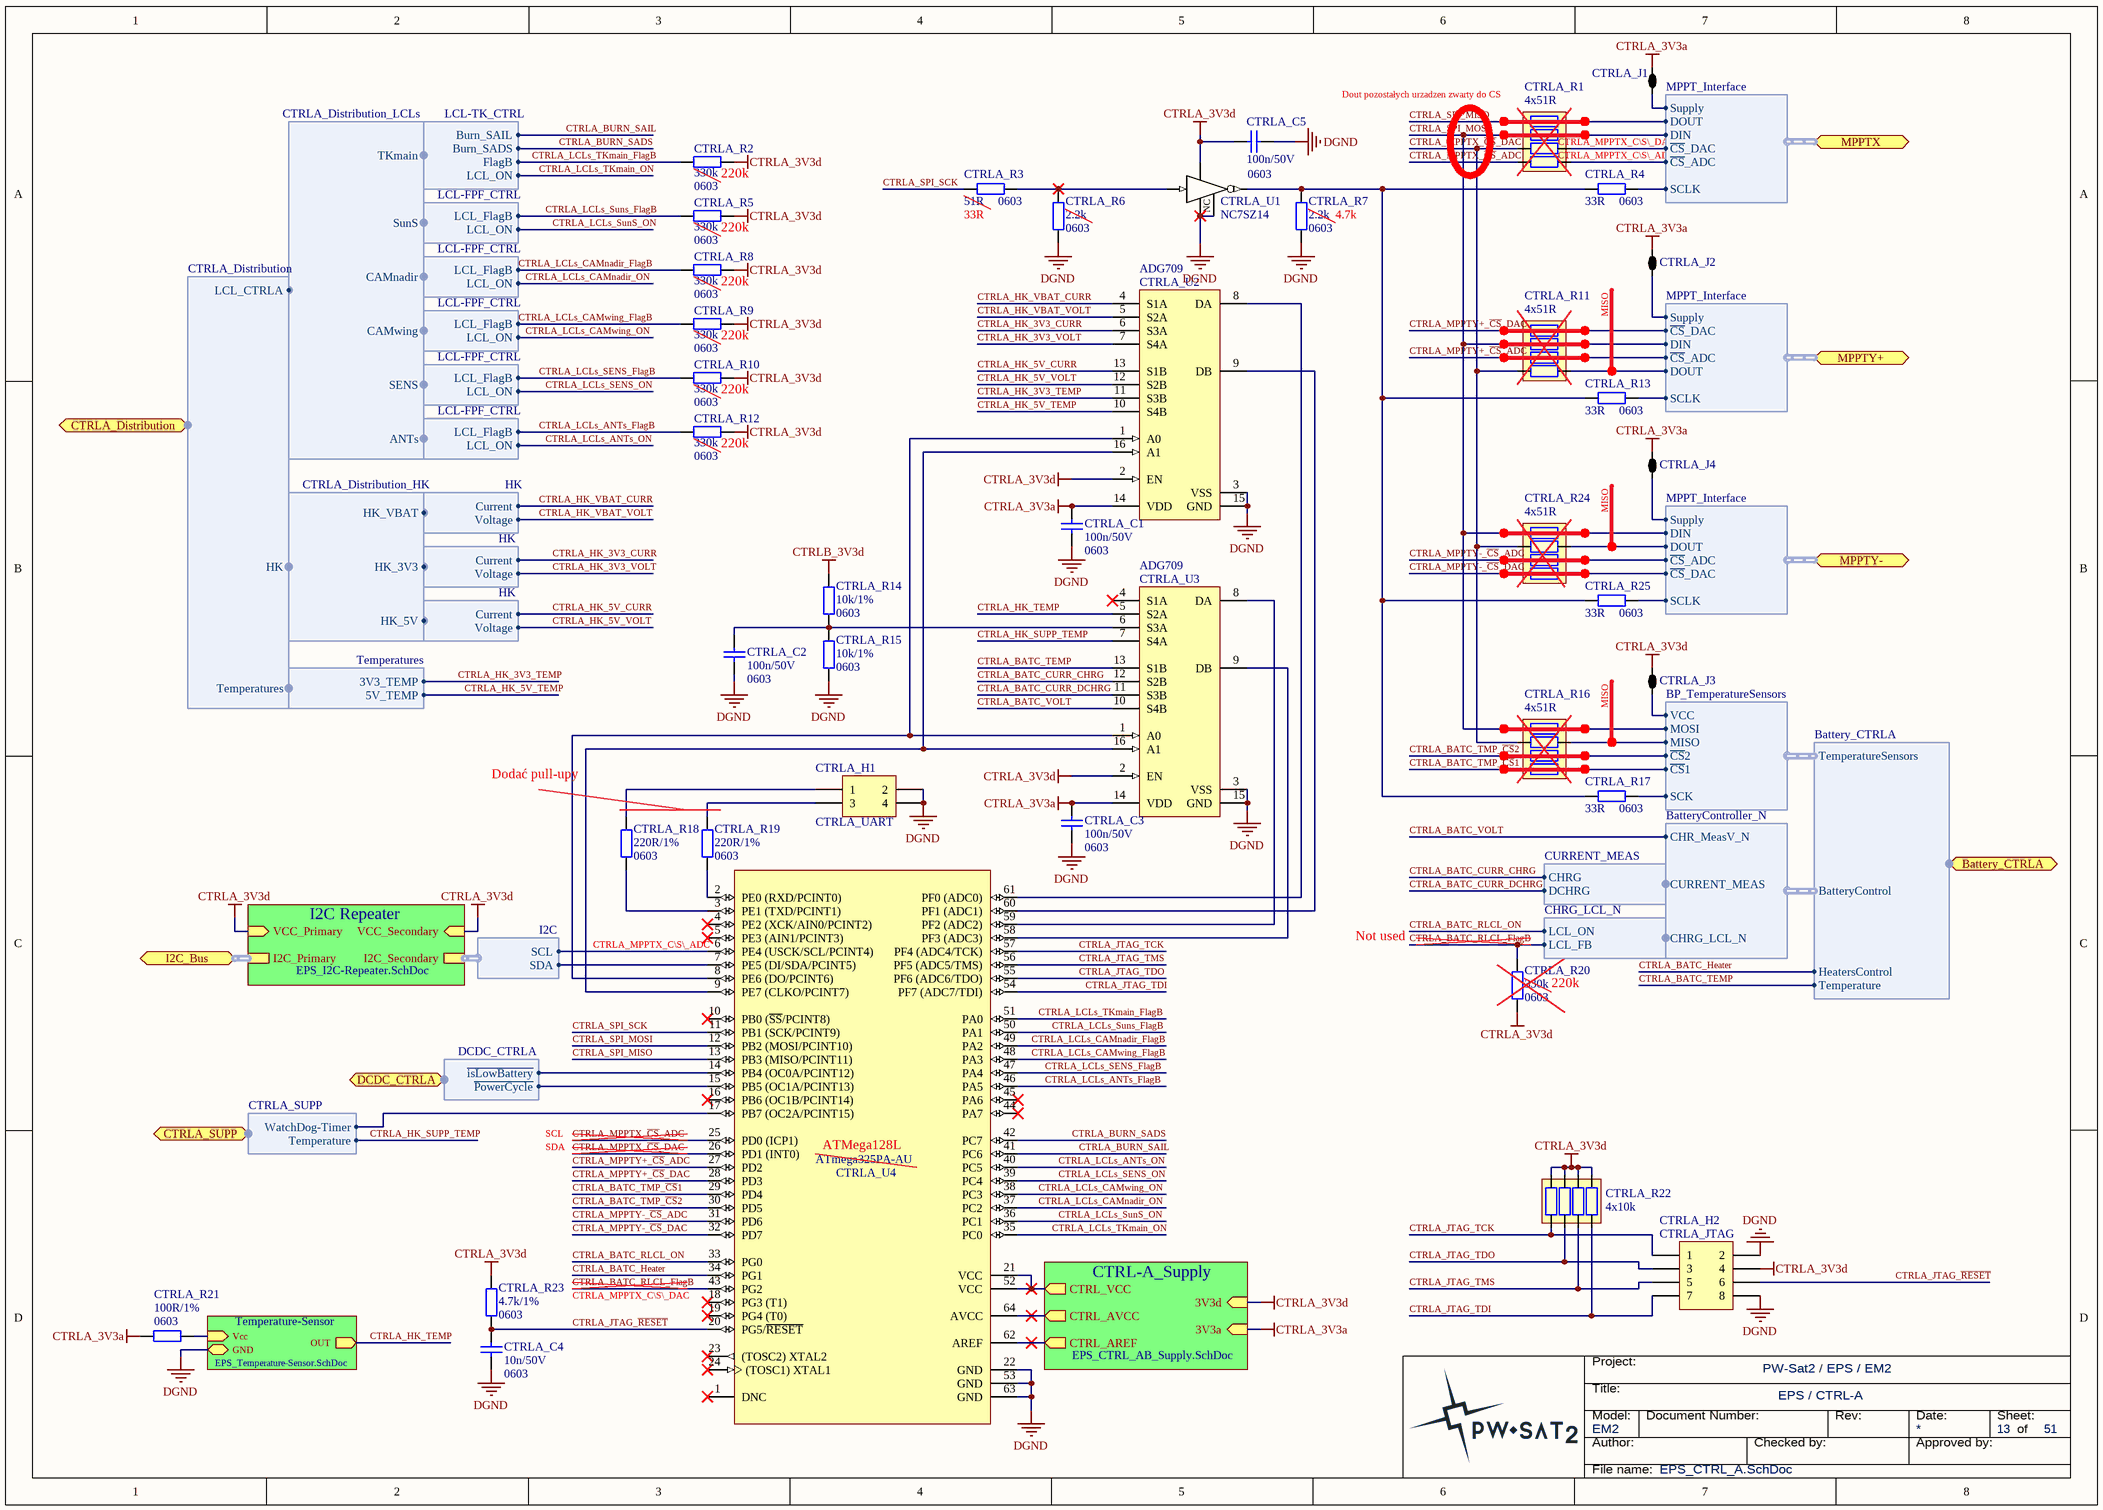
[diagram p8: EPS_CTRL_A.SchDoc]

### Parts
CTRLA_C1  Package: 0603  [SMD_Capacitor_0603]  (hidden comment: 100n/50V)
CTRLA_C2  Package: 0603  [SMD_Capacitor_0603]  (hidden comment: 100n/50V)
CTRLA_C3  Package: 0603  [SMD_Capacitor_0603]  (hidden comment: 100n/50V)
CTRLA_C4  Package: 0603  [SMD_Capacitor_0603]  (hidden comment: 10n/50V)
CTRLA_C5  Package: 0603  [SMD_Capacitor_0603]  (hidden comment: 100n/50V)
CTRLA_H1  CTRLA_UART  [Connfly_DS1031-04-2]
CTRLA_H2  CTRLA_JTAG  [Connfly_DS1031-08-2]
CTRLA_J1  2 way net tie junction  [2way_LP]  (value not drawn)  (net tie, no BOM)
CTRLA_J2  2 way net tie junction  [2way_LP]  (value not drawn)  (net tie, no BOM)
CTRLA_J3  2 way net tie junction  [2way_LP]  (value not drawn)  (net tie, no BOM)
CTRLA_J4  2 way net tie junction  [2way_LP]  (value not drawn)  (net tie, no BOM)
CTRLA_R1  4x51R  [SMD_RESISTOR_ARRAY_YC124]
CTRLA_R2  Package: 0603  [SMD_Resistor_0603]  (hidden comment: 330k)
CTRLA_R3  Package: 0603  [SMD_Resistor_0603]  (hidden comment: 51R)
CTRLA_R4  Package: 0603  [SMD_Resistor_0603]  (hidden comment: 33R)
CTRLA_R5  Package: 0603  [SMD_Resistor_0603]  (hidden comment: 330k)
CTRLA_R6  Package: 0603  [SMD_Resistor_0603]  (hidden comment: 2.2k)
CTRLA_R7  Package: 0603  [SMD_Resistor_0603]  (hidden comment: 2.2k)
CTRLA_R8  Package: 0603  [SMD_Resistor_0603]  (hidden comment: 330k)
CTRLA_R9  Package: 0603  [SMD_Resistor_0603]  (hidden comment: 330k)
CTRLA_R10  Package: 0603  [SMD_Resistor_0603]  (hidden comment: 330k)
CTRLA_R11  4x51R  [SMD_RESISTOR_ARRAY_YC124]
CTRLA_R12  Package: 0603  [SMD_Resistor_0603]  (hidden comment: 330k)
CTRLA_R13  Package: 0603  [SMD_Resistor_0603]  (hidden comment: 33R)
CTRLA_R14  Package: 0603  [SMD_Resistor_0603]  (hidden comment: 10k/1%)
CTRLA_R15  Package: 0603  [SMD_Resistor_0603]  (hidden comment: 10k/1%)
CTRLA_R16  4x51R  [SMD_RESISTOR_ARRAY_YC124]
CTRLA_R17  Package: 0603  [SMD_Resistor_0603]  (hidden comment: 33R)
CTRLA_R18  Package: 0603  [SMD_Resistor_0603]  (hidden comment: 220R/1%)
CTRLA_R19  Package: 0603  [SMD_Resistor_0603]  (hidden comment: 220R/1%)
CTRLA_R20  Package: 0603  [SMD_Resistor_0603]  (hidden comment: 330k)
CTRLA_R21  Package: 0603  [SMD_Resistor_0603]  (hidden comment: 100R/1%)
CTRLA_R22  4x10k  [SMD_RESISTOR_ARRAY_YC124]
CTRLA_R23  Package: 0603  [SMD_Resistor_0603]  (hidden comment: 4.7k/1%)
CTRLA_R24  4x51R  [SMD_RESISTOR_ARRAY_YC124]
CTRLA_R25  Package: 0603  [SMD_Resistor_0603]  (hidden comment: 33R)
CTRLA_U1  NC7SZ14  [SOT23-5]
CTRLA_U2  ADG709  [TSSOP16]
CTRLA_U3  ADG709  [TSSOP16]
CTRLA_U4  value ATmega325PA-AU  [64A_N]  (hidden comment: revD, Jun-2011)

### Sub-sheets
CTRL-A_Supply = EPS_CTRL_AB_Supply.SchDoc: CTRL_VCC (out), CTRL_AVCC (out), CTRL_AREF (out), 3V3d (in), 3V3a (in)
I2C Repeater = EPS_I2C-Repeater.SchDoc: I2C_Primary (harness I2C), I2C_Secondary (harness I2C), VCC_Secondary (in), VCC_Primary (in)
Temperature-Sensor = EPS_Temperature-Sensor.SchDoc: OUT (out), Vcc (in), GND

### Ports
Battery_CTRLA (harness Battery_CTRLA), CTRLA_Distribution (harness CTRLA_Distribution), CTRLA_SUPP (harness CTRLA_SUPP), DCDC_CTRLA (harness DCDC_CTRLA), I2C_Bus (harness I2C), MPPTX (harness MPPT_Interface), MPPTY+ (harness MPPT_Interface), MPPTY- (harness MPPT_Interface)

### Harnesses
I2C: SDA, SCL
MPPT_Interface: DIN, DOUT, SCLK, ~{CS}_DAC, ~{CS}_ADC, Supply
Battery_CTRLA: BatteryControl, HeatersControl, TemperatureSensors, Temperature
BatteryController_N: CHRG_LCL_N, CURRENT_MEAS, CHR_MeasV_N
CURRENT_MEAS: CHRG, DCHRG
CHRG_LCL_N: LCL_FB, LCL_ON
BP_TemperatureSensors: MISO, VCC, ~{CS}1, ~{CS}2, SCK, MOSI
CTRLA_Distribution_LCLs: TKmain, SunS, CAMnadir, CAMwing, SENS, ANTs
CTRLA_Distribution: LCL_CTRLA, HK, Temperatures
HK: Voltage, Current
CTRLA_Distribution_HK: HK_VBAT, HK_3V3, HK_5V
LCL-FPF_CTRL: LCL_FlagB, LCL_ON
LCL-TK_CTRL: FlagB, LCL_ON, Burn_SAIL, Burn_SADS
Temperatures: 3V3_TEMP, 5V_TEMP
DCDC_CTRLA: ~{PowerCycle}, ~{isLowBattery}
CTRLA_SUPP: Temperature, WatchDog-Timer

### Nets
CTRLA_3V3a: CTRLA_C1.1 CTRLA_C3.1 CTRLA_J1.2 CTRLA_J2.2 CTRLA_J4.2 CTRLA_R21.2 CTRLA_U2.14(VDD) CTRLA_U3.14(VDD) ; sheet CTRL-A_Supply/3V3a
CTRLA_3V3d: CTRLA_C5.1 CTRLA_H2.4 CTRLA_J3.2 CTRLA_R2.1 CTRLA_R5.1 CTRLA_R8.1 CTRLA_R9.1 CTRLA_R10.1 CTRLA_R12.1 CTRLA_R20.1 CTRLA_R22.1 CTRLA_R22.2 CTRLA_R22.3 CTRLA_R22.4 CTRLA_R23.2 CTRLA_U1.5(Vcc) CTRLA_U2.2(EN) CTRLA_U3.2(EN) CTRLA_U4.21(VCC) CTRLA_U4.52(VCC) ; sheet I2C Repeater/VCC_Secondary, sheet I2C Repeater/VCC_Primary, sheet CTRL-A_Supply/CTRL_VCC, sheet CTRL-A_Supply/3V3d
CTRLB_3V3d: CTRLA_R14.2
DGND: CTRLA_C1.2 CTRLA_C2.2 CTRLA_C3.2 CTRLA_C4.2 CTRLA_C5.2 CTRLA_H1.2 CTRLA_H1.4 CTRLA_H2.2 CTRLA_H2.8 CTRLA_R6.1 CTRLA_R7.1 CTRLA_R15.1 CTRLA_U1.1(NC) CTRLA_U1.3(GND) CTRLA_U2.3(VSS) CTRLA_U2.15(GND) CTRLA_U3.3(VSS) CTRLA_U3.15(GND) CTRLA_U4.22(GND) CTRLA_U4.53(GND) CTRLA_U4.63(GND) ; sheet Temperature-Sensor/GND
CTRLA_BATC_CURR_CHRG: CTRLA_U3.12(S2B) ; harness CURRENT_MEAS.CHRG
CTRLA_BATC_CURR_DCHRG: CTRLA_U3.11(S3B) ; harness CURRENT_MEAS.DCHRG
CTRLA_BATC_Heater: CTRLA_U4.34(PG1) ; port Battery_CTRLA.HeatersControl
CTRLA_BATC_RLCL_FlagB: CTRLA_R20.2 CTRLA_U4.43(PG2) ; harness CHRG_LCL_N.LCL_FB
CTRLA_BATC_RLCL_ON: CTRLA_U4.33(PG0) ; harness CHRG_LCL_N.LCL_ON
CTRLA_BATC_TEMP: CTRLA_U3.13(S1B) ; port Battery_CTRLA.Temperature
CTRLA_BATC_TMP_~{CS}1: CTRLA_R16.8 CTRLA_U4.29(PD4)
CTRLA_BATC_TMP_~{CS}2: CTRLA_R16.7 CTRLA_U4.30(PD5)
CTRLA_BATC_VOLT: CTRLA_U3.10(S4B) ; harness BatteryController_N.CHR_MeasV_N
CTRLA_BURN_SADS: CTRLA_U4.42(PC7) ; harness LCL-TK_CTRL.Burn_SADS
CTRLA_BURN_SAIL: CTRLA_U4.41(PC6) ; harness LCL-TK_CTRL.Burn_SAIL
CTRLA_HK_3V3_CURR: CTRLA_U2.6(S3A) ; harness HK.Current
CTRLA_HK_3V3_TEMP: CTRLA_U2.11(S3B) ; harness Temperatures.3V3_TEMP
CTRLA_HK_3V3_VOLT: CTRLA_U2.7(S4A) ; harness HK.Voltage
CTRLA_HK_5V_CURR: CTRLA_U2.13(S1B) ; harness HK.Current
CTRLA_HK_5V_TEMP: CTRLA_U2.10(S4B) ; harness Temperatures.5V_TEMP
CTRLA_HK_5V_VOLT: CTRLA_U2.12(S2B) ; harness HK.Voltage
CTRLA_HK_SUPP_TEMP: CTRLA_U3.7(S4A) ; port CTRLA_SUPP.Temperature
CTRLA_HK_TEMP: CTRLA_U3.5(S2A) ; sheet Temperature-Sensor/OUT
CTRLA_HK_VBAT_CURR: CTRLA_U2.4(S1A) ; harness HK.Current
CTRLA_HK_VBAT_VOLT: CTRLA_U2.5(S2A) ; harness HK.Voltage
CTRLA_JTAG_~{RESET}: CTRLA_C4.1 CTRLA_H2.6 CTRLA_R23.1 CTRLA_U4.20(PG5/~{RESET})
CTRLA_JTAG_TCK: CTRLA_H2.1 CTRLA_R22.5 CTRLA_U4.57(PF4_(ADC4/TCK))
CTRLA_JTAG_TDI: CTRLA_H2.7 CTRLA_R22.8 CTRLA_U4.54(PF7_(ADC7/TDI))
CTRLA_JTAG_TDO: CTRLA_H2.3 CTRLA_R22.6 CTRLA_U4.55(PF6_(ADC6/TDO))
CTRLA_JTAG_TMS: CTRLA_H2.5 CTRLA_R22.7 CTRLA_U4.56(PF5_(ADC5/TMS))
CTRLA_LCLs_ANTs_FlagB: CTRLA_R12.2 CTRLA_U4.46(PA5) ; harness LCL-FPF_CTRL.LCL_FlagB
CTRLA_LCLs_ANTs_ON: CTRLA_U4.40(PC5) ; harness LCL-FPF_CTRL.LCL_ON
CTRLA_LCLs_CAMnadir_FlagB: CTRLA_R8.2 CTRLA_U4.49(PA2) ; harness LCL-FPF_CTRL.LCL_FlagB
CTRLA_LCLs_CAMnadir_ON: CTRLA_U4.37(PC2) ; harness LCL-FPF_CTRL.LCL_ON
CTRLA_LCLs_CAMwing_FlagB: CTRLA_R9.2 CTRLA_U4.48(PA3) ; harness LCL-FPF_CTRL.LCL_FlagB
CTRLA_LCLs_CAMwing_ON: CTRLA_U4.38(PC3) ; harness LCL-FPF_CTRL.LCL_ON
CTRLA_LCLs_SENS_FlagB: CTRLA_R10.2 CTRLA_U4.47(PA4) ; harness LCL-FPF_CTRL.LCL_FlagB
CTRLA_LCLs_SENS_ON: CTRLA_U4.39(PC4) ; harness LCL-FPF_CTRL.LCL_ON
CTRLA_LCLs_Suns_FlagB: CTRLA_R5.2 CTRLA_U4.50(PA1) ; harness LCL-FPF_CTRL.LCL_FlagB
CTRLA_LCLs_SunS_ON: CTRLA_U4.36(PC1) ; harness LCL-FPF_CTRL.LCL_ON
CTRLA_LCLs_TKmain_FlagB: CTRLA_R2.2 CTRLA_U4.51(PA0) ; harness LCL-TK_CTRL.FlagB
CTRLA_LCLs_TKmain_ON: CTRLA_U4.35(PC0) ; harness LCL-TK_CTRL.LCL_ON
CTRLA_MPPTX_~{CS}_ADC: CTRLA_R1.8 CTRLA_U4.25(PD0_(ICP1))
CTRLA_MPPTX_~{CS}_DAC: CTRLA_R1.7 CTRLA_R11.8 CTRLA_R16.6 CTRLA_R24.6 CTRLA_U4.26(PD1_(INT0))
CTRLA_MPPTY+_~{CS}_ADC: CTRLA_R11.7 CTRLA_U4.27(PD2)
CTRLA_MPPTY+_~{CS}_DAC: CTRLA_R11.5 CTRLA_U4.28(PD3)
CTRLA_MPPTY-_~{CS}_ADC: CTRLA_R24.7 CTRLA_U4.31(PD6)
CTRLA_MPPTY-_~{CS}_DAC: CTRLA_R24.8 CTRLA_U4.32(PD7)
CTRLA_SPI_MISO: CTRLA_R1.5 CTRLA_U4.13(PB3_(MISO/PCINT11))
CTRLA_SPI_MOSI: CTRLA_R1.6 CTRLA_R11.6 CTRLA_R16.5 CTRLA_R24.5 CTRLA_U4.12(PB2_(MOSI/PCINT10))
CTRLA_SPI_SCK: CTRLA_R3.1 CTRLA_U4.11(PB1_(SCK/PCINT9))
MPPT_3V3a: CTRLA_J1.1 ; port MPPTX.Supply
MPPT_3V3a: CTRLA_J2.1 ; port MPPTY+.Supply  [a separate net that carries the same name]
MPPT_3V3a: CTRLA_J4.1 ; port MPPTY-.Supply  [a separate net that carries the same name]
MPPT_CS_ADC: CTRLA_R1.1 ; port MPPTX.~{CS}_ADC
MPPT_CS_ADC: CTRLA_R11.2 ; port MPPTY+.~{CS}_ADC  [a separate net that carries the same name]
MPPT_CS_ADC: CTRLA_R24.2 ; port MPPTY-.~{CS}_ADC  [a separate net that carries the same name]
MPPT_CS_DAC: CTRLA_R1.2 ; port MPPTX.~{CS}_DAC
MPPT_CS_DAC: CTRLA_R11.4 ; port MPPTY+.~{CS}_DAC  [a separate net that carries the same name]
MPPT_CS_DAC: CTRLA_R24.1 ; port MPPTY-.~{CS}_DAC  [a separate net that carries the same name]
MPPT_DIN: CTRLA_R1.3 ; port MPPTX.DIN
MPPT_DIN: CTRLA_R11.3 ; port MPPTY+.DIN  [a separate net that carries the same name]
MPPT_DIN: CTRLA_R24.4 ; port MPPTY-.DIN  [a separate net that carries the same name]
MPPT_DOUT: CTRLA_R1.4 ; port MPPTX.DOUT
MPPT_DOUT: CTRLA_R11.1 ; port MPPTY+.DOUT  [a separate net that carries the same name]
MPPT_DOUT: CTRLA_R24.3 ; port MPPTY-.DOUT  [a separate net that carries the same name]
MPPT_SCLK: CTRLA_R4.2 ; port MPPTX.SCLK
MPPT_SCLK: CTRLA_R13.2 ; port MPPTY+.SCLK  [a separate net that carries the same name]
MPPT_SCLK: CTRLA_R25.2 ; port MPPTY-.SCLK  [a separate net that carries the same name]
NetCTRL_C3_1_1: CTRLA_U4.64(AVCC) ; sheet CTRL-A_Supply/CTRL_AVCC
NetCTRL_C5_1_1: CTRLA_U4.62(AREF) ; sheet CTRL-A_Supply/CTRL_AREF
NetCTRLA_C2_1: CTRLA_C2.1 CTRLA_R14.1 CTRLA_R15.2 CTRLA_U3.6(S3A)
NetCTRLA_H1_1: CTRLA_H1.1 CTRLA_R18.2
NetCTRLA_H1_3: CTRLA_H1.3 CTRLA_R19.2
NetCTRLA_J3_1: CTRLA_J3.1 ; harness BP_TemperatureSensors.VCC
NetCTRLA_R3_2: CTRLA_R3.2 CTRLA_R6.2 CTRLA_U1.2(A)
NetCTRLA_R4_1: CTRLA_R4.1 CTRLA_R7.2 CTRLA_R13.1 CTRLA_R17.1 CTRLA_R25.1 CTRLA_U1.4(Y)
NetCTRLA_R16_1: CTRLA_R16.1 ; harness BP_TemperatureSensors.~{CS}1
NetCTRLA_R16_2: CTRLA_R16.2 ; harness BP_TemperatureSensors.~{CS}2
NetCTRLA_R16_3: CTRLA_R16.3 ; harness BP_TemperatureSensors.MISO
NetCTRLA_R16_4: CTRLA_R16.4 ; harness BP_TemperatureSensors.MOSI
NetCTRLA_R17_2: CTRLA_R17.2 ; harness BP_TemperatureSensors.SCK
NetCTRLA_R18_1: CTRLA_R18.1 CTRLA_U4.3(PE1_(TXD/PCINT1))
NetCTRLA_R19_1: CTRLA_R19.1 CTRLA_U4.2(PE0_(RXD/PCINT0))
NetCTRLA_R21_1: CTRLA_R21.1 ; sheet Temperature-Sensor/Vcc
NetCTRLA_U2_1: CTRLA_U2.1(A0) CTRLA_U3.1(A0) CTRLA_U4.8(PE6_(DO/PCINT6))
NetCTRLA_U2_8: CTRLA_U2.8(DA) CTRLA_U4.61(PF0_(ADC0))
NetCTRLA_U2_9: CTRLA_U2.9(DB) CTRLA_U4.60(PF1_(ADC1))
NetCTRLA_U2_16: CTRLA_U2.16(A1) CTRLA_U3.16(A1) CTRLA_U4.9(PE7_(CLKO/PCINT7))
NetCTRLA_U3_8: CTRLA_U3.8(DA) CTRLA_U4.59(PF2_(ADC2))
NetCTRLA_U3_9: CTRLA_U3.9(DB) CTRLA_U4.58(PF3_(ADC3))
NetCTRLA_U4_6: CTRLA_U4.6(PE4_(USCK/SCL/PCINT4)) ; sheet I2C Repeater/I2C_Secondary.SCL
NetCTRLA_U4_7: CTRLA_U4.7(PE5_(DI/SDA/PCINT5)) ; sheet I2C Repeater/I2C_Secondary.SDA
NetCTRLA_U4_14: CTRLA_U4.14(PB4_(OC0A/PCINT12)) ; port DCDC_CTRLA.~{isLowBattery}
NetCTRLA_U4_15: CTRLA_U4.15(PB5_(OC1A/PCINT13)) ; port DCDC_CTRLA.~{PowerCycle}
NetCTRLA_U4_17: CTRLA_U4.17(PB7_(OC2A/PCINT15)) ; port CTRLA_SUPP.WatchDog-Timer

Not connected (* = marked no-connect by the designer): CTRLA_U3 4(S1A)*; CTRLA_U4 1(DNC)* 4(PE2_(XCK/AIN0/PCINT2))* 5(PE3_(AIN1/PCINT3))* 10(PB0_(~{SS}/PCINT8))* 16(PB6_(OC1B/PCINT14))* 18(PG3_(T1))* 19(PG4_(T0))* 23((TOSC2)_XTAL2)* 24((TOSC1)_XTAL1)* 44(PA7)* 45(PA6)*

### Buses and harness runs
harness port I2C_Bus = sheet I2C Repeater/I2C_Primary

### Notes on the sheet
- (near CTRLA_R1) Dout pozostałych urzadzen zwarty do CS
- (near CTRLA_R2) 220k
- (near CTRLA_R1) CTRLA_MPPTX_C\S\_ADC
- (near CTRLA_R1) CTRLA_MPPTX_C\S\_DAC
- (near CTRLA_R5) 220k
- (near CTRLA_R3) 33R
- (near CTRLA_R7) 4.7k
- (near CTRLA_R8) 220k
- MISO
- (near CTRLA_R9) 220k
- (near CTRLA_R10) 220k
- (near CTRLA_R12) 220k
- Dodać pull-upy
- (near CTRLA_U4) CTRLA_MPPTX_C\S\_ADC
- Not used
- (near CTRLA_R20) 220k
- SCL
- SDA
- (near CTRLA_U4) ATMega128L
- CTRLA_MPPTX_C\S\_DAC
- Title:
- Project:
- Author:
- Model:
- Document Number:
- Checked by:
- Rev:
- Date:
- Approved by:
- Sheet:
- of
- File name:

### Library data of the parts
CTRLA_C1-CTRLA_C5 = Cer_C0603T104K5RALTU: Ceramic Cap Kemet COTS 100n/50V X7R 0603; Manufacturer: Kemet; ManufacturerPartNumber: C0603T104K5RALTU
  CTRLA_C1-CTRLA_C3 CTRLA_C5: Value: 100n/50V
  CTRLA_C4: Value: 10n/50V
CTRLA_H1 = Header 2X2: Header, 2-Pin, Dual row; LatestRevisionDate: 17-Jul-2002; LatestRevisionNote: Re-released for DXP Platform.; Publisher: Altium Limited
CTRLA_H2 = Header 4X2: Header, 4-Pin, Dual row; LatestRevisionDate: 17-Jul-2002; LatestRevisionNote: Re-released for DXP Platform.; Publisher: Altium Limited
CTRLA_J1-CTRLA_J4 = 2way: ComponentLink1URL: http://www.edatools.cz/addons; ComponentLink1Description: Source; FootprintNote: LP=12mil, MP=40mil, HP=120mil
CTRLA_R1 CTRLA_R11 CTRLA_R16 CTRLA_R22 CTRLA_R24 = YC124-JR-072K2L: RESISTOR ARRAY, 4 x 0402; URL: http://pl.farnell.com/yageo-phycomp/yc124-jr-072k2l/resistor-array-arv341-4-x-0402/dp/9235388
CTRLA_R2-CTRLA_R10 CTRLA_R12-CTRLA_R15 CTRLA_R17-CTRLA_R20 CTRLA_R23 CTRLA_R25 = CRCW06034K70FKxxxx: 4.7k/1% Vishay CRCW 0603 Resistor. 100mW, 100ppm, 75V.; Manufacturer: Vishay; ManufactuerPartNumber: CRCW06034K70FKxxxx
  CTRLA_R2 CTRLA_R5 CTRLA_R8-CTRLA_R10 CTRLA_R12 CTRLA_R20: Value: 330k
  CTRLA_R3: Value: 51R
  CTRLA_R4 CTRLA_R13 CTRLA_R17 CTRLA_R25: Value: 33R
  CTRLA_R6 CTRLA_R7: Value: 2.2k
  CTRLA_R14 CTRLA_R15: Value: 10k/1%
  CTRLA_R18 CTRLA_R19: Value: 220R/1%
  CTRLA_R23: Value: 4.7k/1%
CTRLA_R21 = CRCW06031K00FKxxxx: 1k/1% Vishay CRCW 0603 Resistor. 100mW, 100ppm, 75V.; Manufacturer: Vishay; ManufacturerPartNumber: CRCW06031K00FKxxxx; Value: 100R/1%
CTRLA_U1 = NC7SZ14: TinyLogic UHS TinyLogic UHS Two-Input NAND Gate.; Manufacturer: Fairchild Semiconductor; Value: NC7SZ14
CTRLA_U2 CTRLA_U3 = ADG709: CMOS Analog 4-Channel Multiplexer; Manufacturer: Analog Devices; ManufacturerPartNumber: ADG709
CTRLA_U4 = ATmega325PA-AU: 8-bit AVR Microcontroller, 1.5-5.5V, 32KB Flash, 1KB EEPROM, 2KB SRAM, 64-pin TQFP, Industrial Grade (-40°C to 85°C); DatasheetVersion: revD, Jun-2011; PackageVersion: revC, Oct-2010; PackageReference: 64A; PackageDescription: 64-Pin Plastic Thin Profile Quad Flat Pack, 14 x 14 x 1.0 mm Body, 0.8 mm Pitch (TQFP); Code_JEDEC: MS-026-AEB; ComponentLink1Description: Manufacturer URL; ComponentLink1URL: http://www.atmel.com/; ComponentLink2Description: ATmega165A/PA/325A/PA/3250A/PA/645A/P/6450A/P Datasheet; ComponentLink2URL: http://www.atmel.com/dyn/resources/prod_documents/doc8285.pdf; ComponentLink3Description: ATmega165A/PA/325A/PA/3250A/PA/645A/P/6450A/P Summary; ComponentLink3URL: http://www.atmel.com/dyn/resources/prod_documents/8285S.pdf